# EAGLE board whitherbone (EAGLE 6.4), part 1 of 2
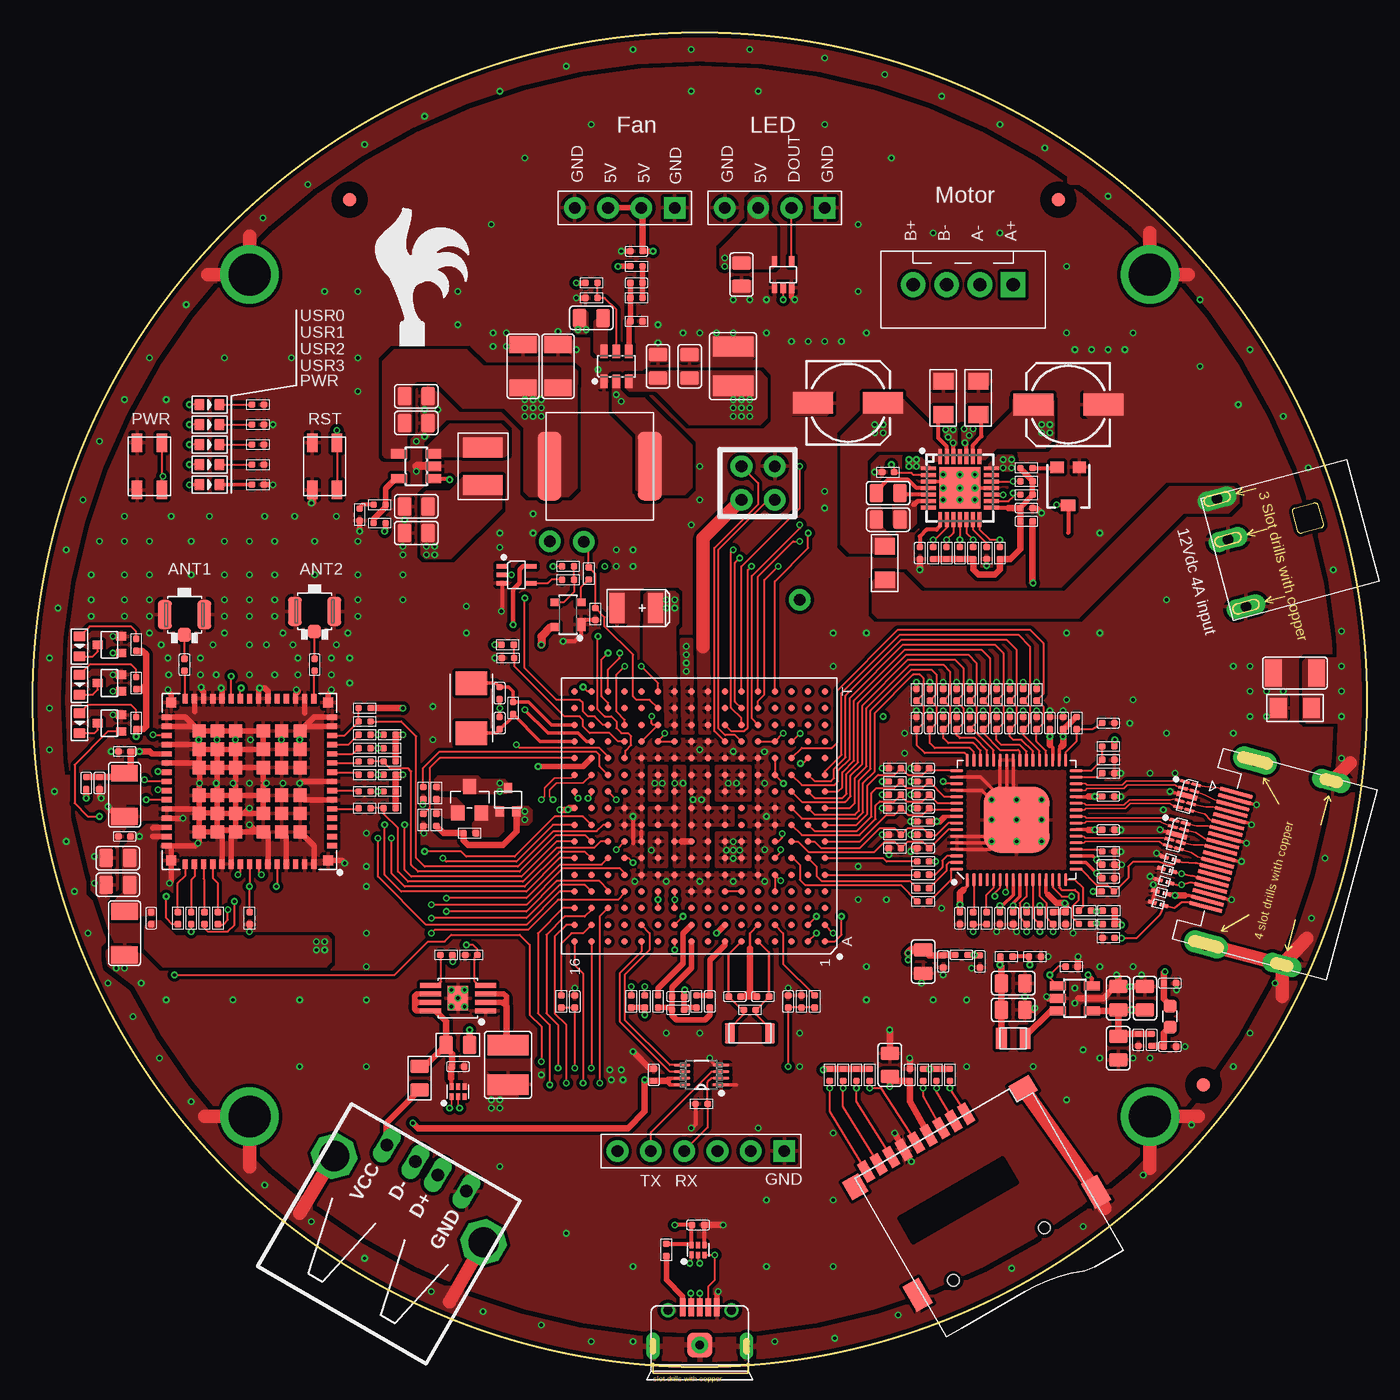
[diagram p9: board, top side]
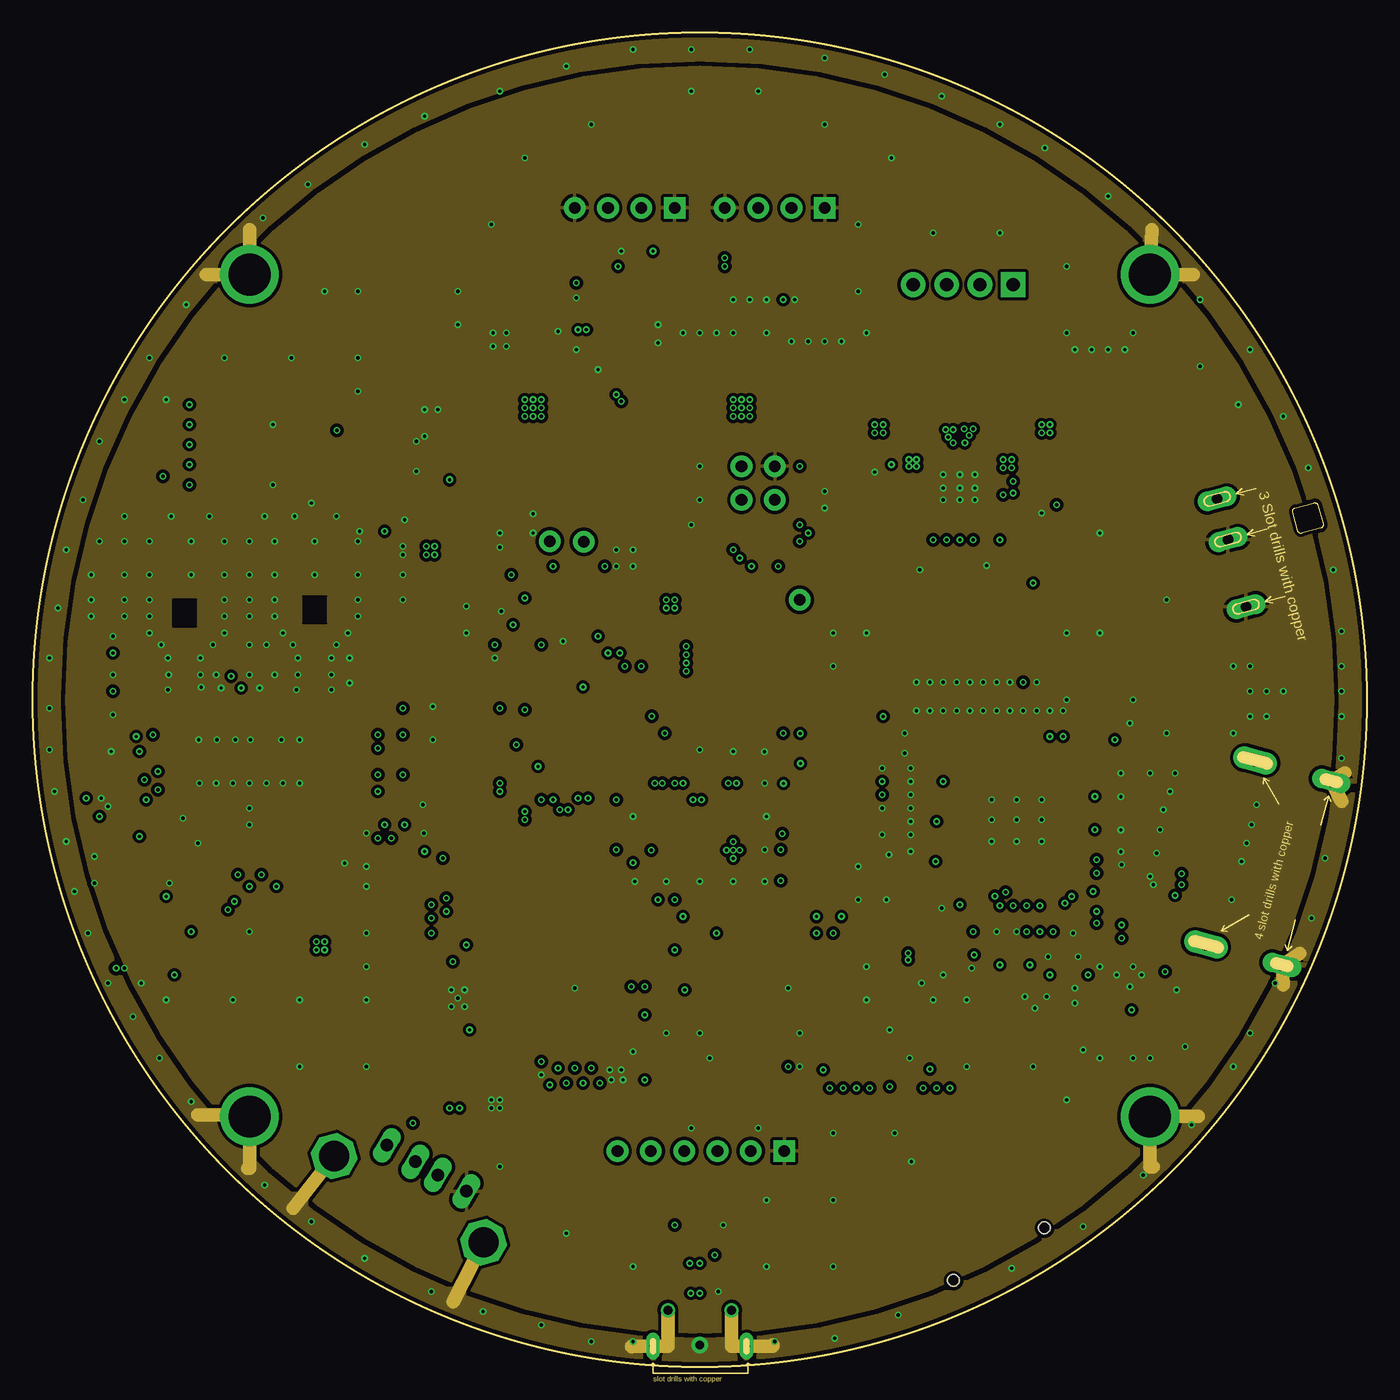
[diagram p10: board, inner layer GND2]
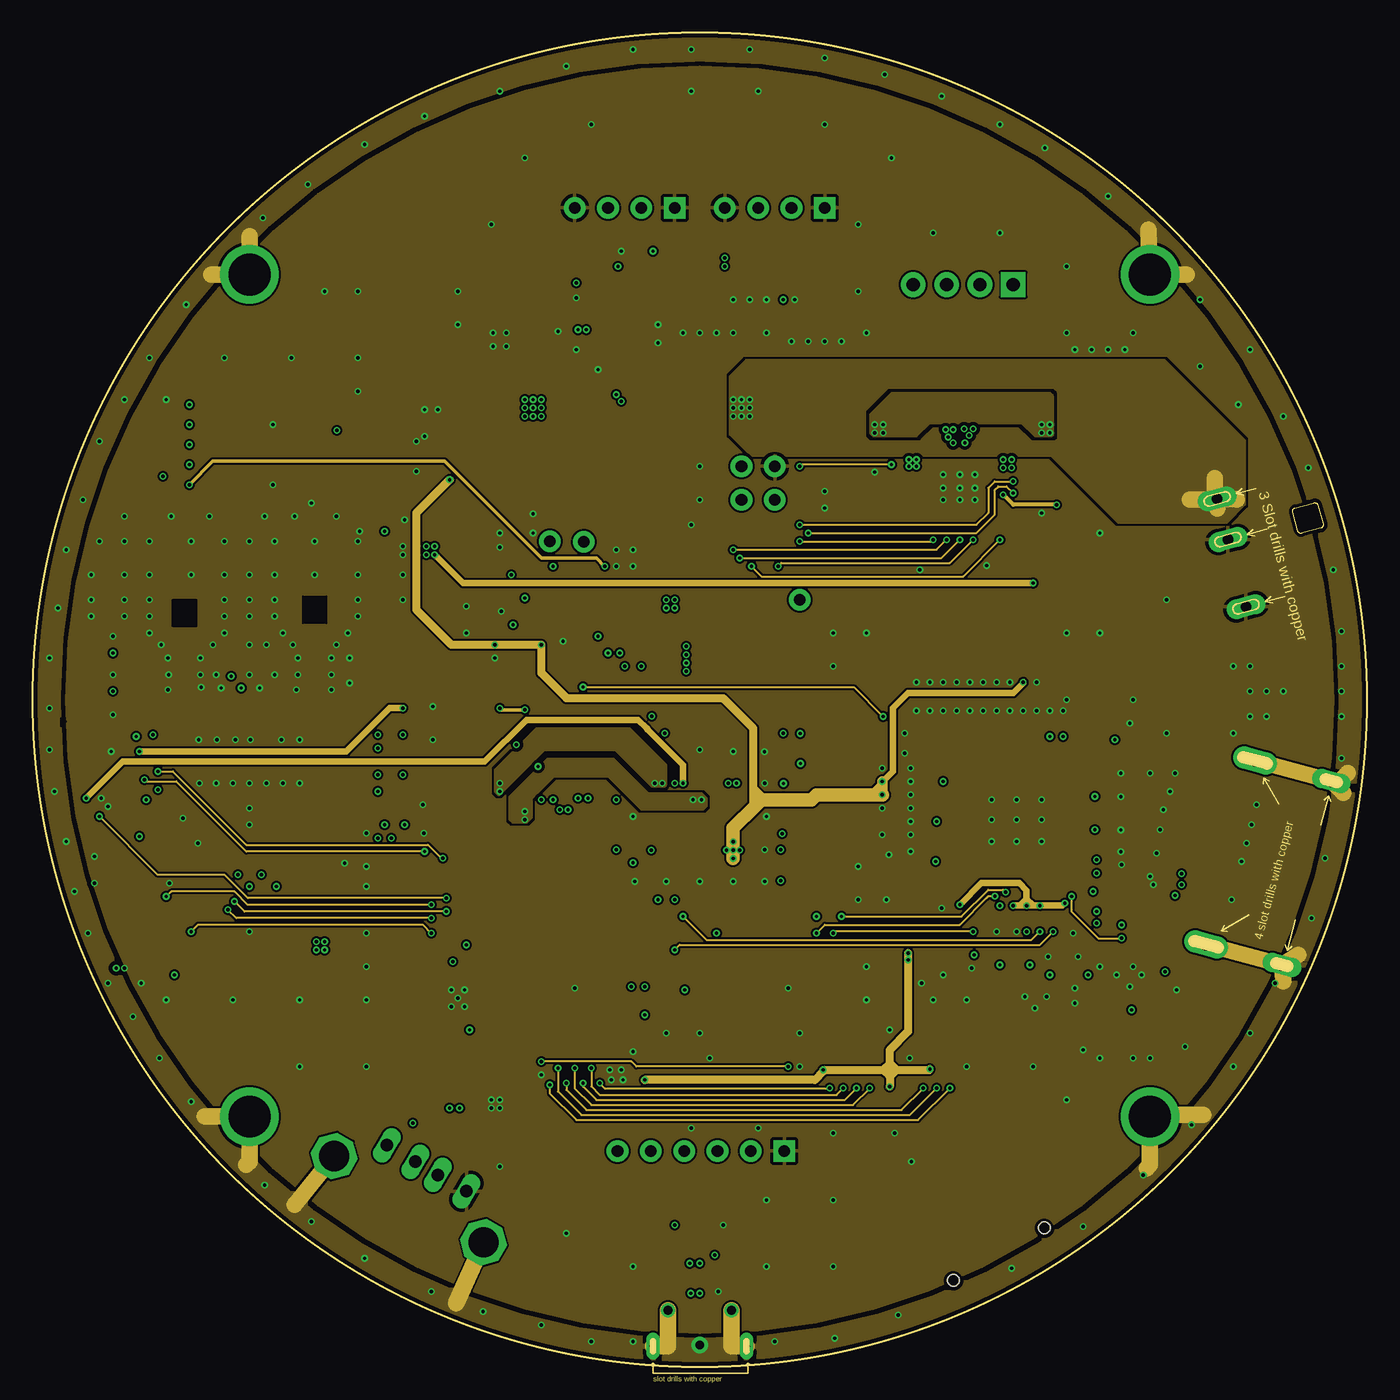
[diagram p11: board, inner layer Route15]
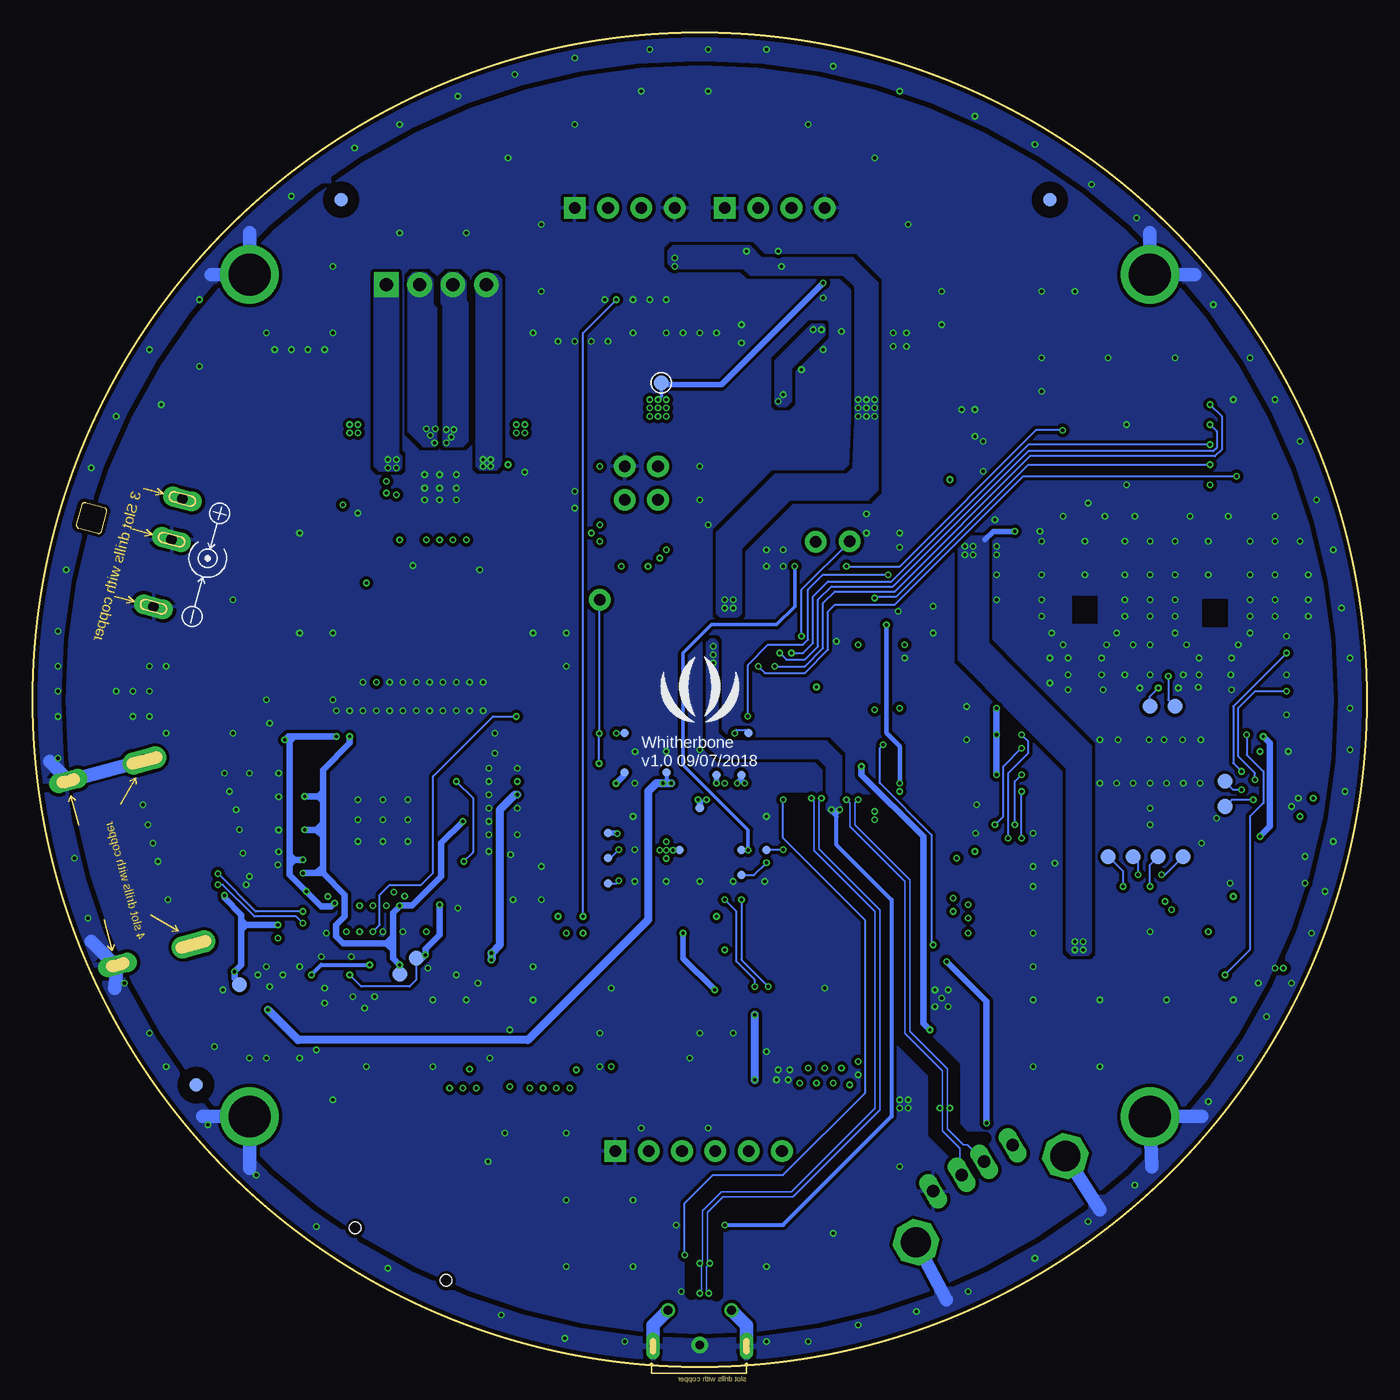
[diagram p12: board, bottom side, seen from below]

Size 101.6 x 101.6 mm. Coordinates in mm from the lower left corner, seen from the top.
Outline: circle at 50.8,50.8 radius 50.8
Copper layers (1*2*15*16): Top 0.035mm / dielectric 0.2mm / GND2 0.0175mm / dielectric 0.3mm / Route15 0.0175mm / dielectric 0.2mm / Bottom 0.035mm
Design rules "SeeedStudio_4layer_DRU_no_angle_20140221 *": minimum track width 1mil, minimum drill 10mil, track to track 6mil, track to pad 6mil, pad to pad 6mil, via to via 6mil, smd to smd 0mil, copper to edge 10mil, drill to drill 8mil, minimum pad ring 4mil, minimum via ring 4mil, stop-mask expansion 4mil, vias tented up to drill 25mil, thermal gap 10mil
Net classes: 0 default: width 0.102 mm, drill 0.254 mm; 1 ground: width 0.102 mm, drill 0.254 mm, clearance 0.152 mm
bRestrict: 11 lines

## Footprints (pad centres in the part's own frame; a part is rotated, then mirrored left to right if it is on the bottom)
U-FL3P-SMD-2.6X2.6X1.0MM = smd 1.05 x 1: D -1.524,0 | smd 2.2 x 1.05: GND1 0,1.5; GND2 0,-1.5
AVX-B = smd 1.143 x 2.286: + 1.46,0; - -1.46,0
C0402 = smd 0.5 x 0.5: 1 0,0.463; 2 0,-0.463
C1206 = smd 1.27 x 2.032: 1 -1.651,0; 2 1.651,0
C0805 = smd 1.397 x 1.016: 1 0,0.889; 2 0,-0.889
C1210 = smd 1.55 x 3.1: 1 -1.5,0; 2 1.5,0
ELECTRO-SMD-C-6MM = smd 3.048 x 1.651: + 2.667,0; - -2.667,0
LED-0603 = smd 0.762 x 0.889: + 0.762,0; - -0.762,0
SOD-923 = smd 0.7 x 0.3: 1 -0.45,0; 2 0.45,0
F0603 = smd 1 x 1: 1 -0.8,0; 2 0.8,0
FIDUCIAL_40MIL = smd 1.016 x 1.016: P$1 0,0
SON6-0.5-1.45X1X0.55MM = smd 0.3 x 0.52: 1 -0.5,-0.38 | smd 0.3 x 0.49: 2 0,-0.375; 3 0.5,-0.375; 4 0.5,0.375; 5 0,0.375; 6 -0.5,0.375
MICRO-USB5+5P-SMD-0.65-7.2X5.06MM = smd 0.4 x 1.35: 1 -1.3,2.875; 2 -0.65,2.875; 3 0,2.875; 4 0.65,2.875; 5 1.3,2.875 | smd 1.9 x 1.9: P1 0,0 | drill 0.508 pad 1.016 long: P3 -3.575,-0.08; P4 3.575,-0.08 | drill 0.7: P5 -2.425,2.65; P6 2.425,2.65
DCJ3P-11.6X9.6X7.0MM = drill 0.813 pad 1.524 long: + 4.45,10.3; - -4.05,10.3; CDN 1.25,10.3
MICRO-SD9+4P-SMD-16.1X14.5X1.85MM = smd 1.6 x 0.7: 1 0,2.25; 2 0,1.15; 3 0,0.05; 4 0,-1.05; 5 0,-2.15; 6 0,-3.25; 7 0,-4.35; 8 0,-5.45; 9 0,-6.55 | smd 1.6 x 1.4: G1 0.6,-7.85 | smd 2.2 x 1.4: G2 10.1,-7.85; G3 10.1,7.85 | smd 1.4 x 1.8: G4 0.5,6.95 | hole 0.9: 10.5,-4.95; 10.5,3.05
H6-2.54 = drill 0.889 pad 1.651 square: 1 0,6.35 | drill 0.889 pad 1.651: 2 0,3.81; 3 0,1.27; 4 0,-1.27; 5 0,-3.81; 6 0,-6.35
H4-2.54-10.2X5.6MM = drill 1.016 pad 1.88 square: 1 -3.81,0 | drill 1.016 pad 1.88: 2 -1.27,0; 3 1.27,0; 4 3.81,0
HDMI19P-0.5-15X12.15X6.18MM = smd 0.3 x 2.6: 1 4.5,0; 2 4,0; 3 3.5,0; 4 3,0; 5 2.5,0; 6 2,0; 7 1.5,0; 8 1,0; 9 0.5,0; 10 0,0; 11 -0.5,0; 12 -1,0; 13 -1.5,0; 14 -2,0; 15 -2.5,0; 16 -3,0; 17 -3.5,0; 18 -4,0; 19 -4.5,0 | drill 0.9 pad 1.7 long: PAD 7.25,-0.76; PAD1 -7.25,-0.76 | drill 0.9 pad 1.5 long: PAD2 7.25,-6.76; PAD3 -7.25,-6.76
H4-2.54 = drill 0.889 pad 1.651 square: 1 0,3.81 | drill 0.889 pad 1.651: 2 0,1.27; 3 0,-1.27; 4 0,-3.81
USB4+2-2.0-90D = drill 0.95 long: 1 -3.5,2.71; 2 -1,2.71; 3 1,2.71; 4 3.5,2.71 | drill 2.3 octagon: SG1 -6.57,0; SG2 6.57,0
L0402 = smd 0.5 x 0.5: 1 -0.463,0; 2 0.463,0
INT2-7.268-8.64X8.18X4MM = smd 1.8 x 5.2: 1 -3.82,0; 2 3.82,0
L0805 = smd 1.016 x 1.397: 1 -0.889,0; 2 0.889,0
L4.4X3.0MM = smd 1.55 x 3: 1 -1.425,0; 2 1.425,0
L201610 = smd 0.8 x 1.6: 1 -0.9,0; 2 0.9,0
MOUNTING_HOLE = drill 3.175 pad 4.445: P$1 0,0
SOT-323 = smd 0.635 x 0.762: 1 -0.635,-0.889; 2 0.635,-0.889; 3 0,0.889
R0402 = smd 0.5 x 0.5: 1 0,0.463; 2 0,-0.463
R1206 = smd 1.27 x 1.524: 1 -1.27,0; 2 1.27,0
BUTTON4P-SMD-4.5X3.2X2.5MM = smd 1.4 x 0.8: 1 -1.8,-0.94; 2 1.8,-0.94; 3 1.8,0.94; 4 -1.8,0.94
TP_4545 = smd 1.143 x 1.143: T 0,0
TP_B0,65 = smd 0.635 x 0.635: TP 0,0
TESTPAD/W_HOLE_1X1 = drill 0.889 pad 1.651: P$1 0,0
TP-D65/35MIL = drill 0.889 pad 1.651: P1 0,0
TP-D45MIL = smd 1.143 x 1.143: T 0,0
BGA256-1.27-21X21MM = smd 0.5 x 0.5: A1 -9.525,-9.525; A2 -9.525,-8.255; A3 -9.525,-6.985; A4 -9.525,-5.715; A5 -9.525,-4.445; A6 -9.525,-3.175; A7 -9.525,-1.905; A8 -9.525,-0.635; A9 -9.525,0.635; A10 -9.525,1.905; A11 -9.525,3.175; A12 -9.525,4.445; A13 -9.525,5.715; A14 -9.525,6.985; A15 -9.525,8.255; A16 -9.525,9.525; B1 -8.255,-9.525; B2 -8.255,-8.255; B3 -8.255,-6.985; B4 -8.255,-5.715; B5 -8.255,-4.445; B6 -8.255,-3.175; B7 -8.255,-1.905; B8 -8.255,-0.635; B9 -8.255,0.635; B10 -8.255,1.905; B11 -8.255,3.175; B12 -8.255,4.445; B13 -8.255,5.715; B14 -8.255,6.985; B15 -8.255,8.255; B16 -8.255,9.525; C1 -6.985,-9.525; C2 -6.985,-8.255; C3 -6.985,-6.985; C4 -6.985,-5.715; C5 -6.985,-4.445; C6 -6.985,-3.175; C7 -6.985,-1.905; C8 -6.985,-0.635; C9 -6.985,0.635; C10 -6.985,1.905; C11 -6.985,3.175; C12 -6.985,4.445; C13 -6.985,5.715; C14 -6.985,6.985; C15 -6.985,8.255; C16 -6.985,9.525; D1 -5.715,-9.525; D2 -5.715,-8.255; D3 -5.715,-6.985; D4 -5.715,-5.715; D5 -5.715,-4.445; D6 -5.715,-3.175; D7 -5.715,-1.905; D8 -5.715,-0.635; D9 -5.715,0.635; D10 -5.715,1.905; D11 -5.715,3.175; D12 -5.715,4.445; D13 -5.715,5.715; D14 -5.715,6.985; D15 -5.715,8.255; D16 -5.715,9.525; E1 -4.445,-9.525; E2 -4.445,-8.255; E3 -4.445,-6.985; E4 -4.445,-5.715; E5 -4.445,-4.445; E6 -4.445,-3.175; E7 -4.445,-1.905; E8 -4.445,-0.635; E9 -4.445,0.635; E10 -4.445,1.905; E11 -4.445,3.175; E12 -4.445,4.445; E13 -4.445,5.715; E14 -4.445,6.985; E15 -4.445,8.255; E16 -4.445,9.525; F1 -3.175,-9.525; F2 -3.175,-8.255; F3 -3.175,-6.985; F4 -3.175,-5.715; F5 -3.175,-4.445; F6 -3.175,-3.175; F7 -3.175,-1.905; F8 -3.175,-0.635; F9 -3.175,0.635; F10 -3.175,1.905; F11 -3.175,3.175; F12 -3.175,4.445; F13 -3.175,5.715; F14 -3.175,6.985; F15 -3.175,8.255; F16 -3.175,9.525; G1 -1.905,-9.525; G2 -1.905,-8.255; G3 -1.905,-6.985; G4 -1.905,-5.715; G5 -1.905,-4.445; G6 -1.905,-3.175; G7 -1.905,-1.905; G8 -1.905,-0.635; G9 -1.905,0.635; G10 -1.905,1.905; G11 -1.905,3.175; G12 -1.905,4.445; G13 -1.905,5.715; G14 -1.905,6.985; G15 -1.905,8.255; G16 -1.905,9.525; H1 -0.635,-9.525; H2 -0.635,-8.255; H3 -0.635,-6.985; H4 -0.635,-5.715; H5 -0.635,-4.445; H6 -0.635,-3.175; H7 -0.635,-1.905; H8 -0.635,-0.635; H9 -0.635,0.635; H10 -0.635,1.905; H11 -0.635,3.175; H12 -0.635,4.445; H13 -0.635,5.715; H14 -0.635,6.985; H15 -0.635,8.255; H16 -0.635,9.525; J1 0.635,-9.525; J2 0.635,-8.255; J3 0.635,-6.985; J4 0.635,-5.715; J5 0.635,-4.445; J6 0.635,-3.175; J7 0.635,-1.905; J8 0.635,-0.635; J9 0.635,0.635; J10 0.635,1.905; J11 0.635,3.175; J12 0.635,4.445; J13 0.635,5.715; J14 0.635,6.985; J15 0.635,8.255; J16 0.635,9.525; K1 1.905,-9.525; K2 1.905,-8.255; K3 1.905,-6.985; K4 1.905,-5.715; K5 1.905,-4.445; K6 1.905,-3.175; K7 1.905,-1.905; K8 1.905,-0.635; K9 1.905,0.635; K10 1.905,1.905; K11 1.905,3.175; K12 1.905,4.445; K13 1.905,5.715; K14 1.905,6.985; K15 1.905,8.255; K16 1.905,9.525; L1 3.175,-9.525; L2 3.175,-8.255; L3 3.175,-6.985; L4 3.175,-5.715; L5 3.175,-4.445; L6 3.175,-3.175; L7 3.175,-1.905; L8 3.175,-0.635; L9 3.175,0.635; L10 3.175,1.905; L11 3.175,3.175; L12 3.175,4.445; L13 3.175,5.715; L14 3.175,6.985; L15 3.175,8.255; L16 3.175,9.525; M1 4.445,-9.525; M2 4.445,-8.255; M3 4.445,-6.985; M4 4.445,-5.715; M5 4.445,-4.445; M6 4.445,-3.175; M7 4.445,-1.905; M8 4.445,-0.635; M9 4.445,0.635; M10 4.445,1.905; M11 4.445,3.175; M12 4.445,4.445; M13 4.445,5.715; M14 4.445,6.985; M15 4.445,8.255; M16 4.445,9.525; N1 5.715,-9.525; N2 5.715,-8.255; N3 5.715,-6.985; N4 5.715,-5.715; N5 5.715,-4.445; N6 5.715,-3.175; N7 5.715,-1.905; N8 5.715,-0.635; N9 5.715,0.635; N10 5.715,1.905; N11 5.715,3.175; N12 5.715,4.445; N13 5.715,5.715; N14 5.715,6.985; N15 5.715,8.255; N16 5.715,9.525; P1 6.985,-9.525; P2 6.985,-8.255; P3 6.985,-6.985; P4 6.985,-5.715; P5 6.985,-4.445; P6 6.985,-3.175; P7 6.985,-1.905; P8 6.985,-0.635; P9 6.985,0.635; P10 6.985,1.905; P11 6.985,3.175; P12 6.985,4.445; P13 6.985,5.715; P14 6.985,6.985; P15 6.985,8.255; P16 6.985,9.525; R1 8.255,-9.525; R2 8.255,-8.255; R3 8.255,-6.985; R4 8.255,-5.715; R5 8.255,-4.445; R6 8.255,-3.175; R7 8.255,-1.905; R8 8.255,-0.635; R9 8.255,0.635; R10 8.255,1.905; R11 8.255,3.175; R12 8.255,4.445; R13 8.255,5.715; R14 8.255,6.985; R15 8.255,8.255; R16 8.255,9.525; T1 9.525,-9.525; T2 9.525,-8.255; T3 9.525,-6.985; T4 9.525,-5.715; T5 9.525,-4.445; T6 9.525,-3.175; T7 9.525,-1.905; T8 9.525,-0.635; T9 9.525,0.635; T10 9.525,1.905; T11 9.525,3.175; T12 9.525,4.445; T13 9.525,5.715; T14 9.525,6.985; T15 9.525,8.255; T16 9.525,9.525
5P-SMD-2X1.2X1MM = smd 0.35 x 0.85: 1 -0.65,-1.1; 2 0,-1.1; 3 0.65,-1.1; 4 0.65,1.1; 5 -0.65,1.1
SOT-23 = smd 1.016 x 1.143: 1 -0.889,-1.016; 2 0.889,-1.016; 3 0,1.016
MODULE100P-0.7-13.5X13.2MM = smd 0.75 x 0.75: 1 -6.025,-5.975; 17 6.025,-5.975; 33 6.025,5.975; 49 -6.025,5.975 | smd 0.4 x 0.75: 2 -4.9,-6.3; 3 -4.2,-6.3; 4 -3.5,-6.3; 5 -2.8,-6.3; 6 -2.1,-6.3; 7 -1.4,-6.3; 8 -0.7,-6.3; 9 0,-6.3; 10 0.7,-6.3; 11 1.4,-6.3; 12 2.1,-6.3; 13 2.8,-6.3; 14 3.5,-6.3; 15 4.2,-6.3; 16 4.9,-6.3; 34 4.9,6.3; 35 4.2,6.3; 36 3.5,6.3; 37 2.8,6.3; 38 2.1,6.3; 39 1.4,6.3; 40 0.7,6.3; 41 0,6.3; 42 -0.7,6.3; 43 -1.4,6.3; 44 -2.1,6.3; 45 -2.8,6.3; 46 -3.5,6.3; 47 -4.2,6.3; 48 -4.9,6.3 | smd 0.75 x 0.4: 18 6.3,-4.9; 19 6.3,-4.2; 20 6.3,-3.5; 21 6.3,-2.8; 22 6.3,-2.1; 23 6.3,-1.4; 24 6.3,-0.7; 25 6.3,0; 26 6.3,0.7; 27 6.3,1.4; 28 6.3,2.1; 29 6.3,2.8; 30 6.3,3.5; 31 6.3,4.2; 32 6.3,4.9; 50 -6.3,4.9; 51 -6.3,4.2; 52 -6.3,3.5; 53 -6.3,2.8; 54 -6.3,2.1; 55 -6.3,1.4; 56 -6.3,0.7; 57 -6.3,0; 58 -6.3,-0.7; 59 -6.3,-1.4; 60 -6.3,-2.1; 61 -6.3,-2.8; 62 -6.3,-3.5; 63 -6.3,-4.2; 64 -6.3,-4.9 | smd 1 x 1: G1 -3.85,-3.85; G2 -2.45,-3.85; G3 -1.05,-3.85; G4 1.05,-3.85; G5 2.45,-3.85; G6 3.85,-3.85; G7 -3.85,-2.45; G8 -2.45,-2.45; G9 -1.05,-2.45; G10 1.05,-2.45; G11 2.45,-2.45; G12 3.85,-2.45; G13 -3.85,-1.05; G14 -2.45,-1.05; G15 -1.05,-1.05; G16 1.05,-1.05; G17 2.45,-1.05; G18 3.85,-1.05; G19 -3.85,1.05; G20 -2.45,1.05; G21 -1.05,1.05; G22 1.05,1.05; G23 2.45,1.05; G24 3.85,1.05; G25 -3.85,2.45; G26 -2.45,2.45; G27 -1.05,2.45; G28 1.05,2.45; G29 2.45,2.45; G30 3.85,2.45; G31 -3.85,3.85; G32 -2.45,3.85; G33 -1.05,3.85; G34 1.05,3.85; G35 2.45,3.85; G36 3.85,3.85
SOT143-R = smd 1 x 0.7: 1 -0.75,-1 | smd 0.6 x 0.7: 2 0.95,-1; 3 0.95,1; 4 -0.95,1
SOT-23-6 = smd 0.55 x 1.016: 1 -0.95,-1.143; 2 0,-1.143; 3 0.95,-1.143; 4 0.95,1.143; 5 0,1.143; 6 -0.95,1.143
MSOP8-0.65-3X3MM = smd 0.4 x 1.6: 1 -0.975,-2.1; 2 -0.325,-2.1; 3 0.325,-2.1; 4 0.975,-2.1; 5 0.975,2.1; 6 0.325,2.1; 7 -0.325,2.1; 8 -0.975,2.1 | smd 1.89 x 1.57: 9 0,0
SOT-23-5 = smd 0.69 x 1.2: 1 -0.95,-1.3; 2 0,-1.3; 3 0.95,-1.3; 4 0.95,1.3; 5 -0.95,1.3
SOT-353 = smd 0.4 x 0.8: 1 -0.65,-1; 2 0,-1; 3 0.65,-1; 4 0.65,1; 5 -0.65,1
DCU8 = smd 1.27 x 0.254: 1 -1.473,0.749; 2 -1.473,0.249; 3 -1.473,-0.249; 4 -1.473,-0.749; 5 1.473,-0.749; 6 1.473,-0.249; 7 1.473,0.249; 8 1.473,0.749
QFN64-0.5-9X9MM = smd 1 x 0.25: 1 -4.55,3.75; 2 -4.55,3.25; 3 -4.55,2.75; 4 -4.55,2.25; 5 -4.55,1.75; 6 -4.55,1.25; 7 -4.55,0.75; 8 -4.55,0.25; 9 -4.55,-0.25; 10 -4.564,-0.75; 11 -4.55,-1.25; 12 -4.55,-1.75; 13 -4.55,-2.25; 14 -4.55,-2.75; 15 -4.55,-3.25; 16 -4.55,-3.75; 33 4.55,-3.75; 34 4.55,-3.25; 35 4.55,-2.75; 36 4.55,-2.25; 37 4.55,-1.75; 38 4.55,-1.25; 39 4.55,-0.75; 40 4.55,-0.25; 41 4.55,0.25; 42 4.55,0.75; 43 4.55,1.25; 44 4.55,1.75; 45 4.55,2.25; 46 4.55,2.75; 47 4.55,3.25; 48 4.55,3.75 | smd 0.25 x 1: 17 -3.75,-4.55; 18 -3.25,-4.55; 19 -2.75,-4.55; 20 -2.25,-4.55; 21 -1.75,-4.55; 22 -1.25,-4.55; 23 -0.75,-4.55; 24 -0.25,-4.55; 25 0.25,-4.55; 26 0.75,-4.55; 27 1.25,-4.55; 28 1.75,-4.55; 29 2.25,-4.55; 30 2.75,-4.55; 31 3.25,-4.55; 32 3.75,-4.55; 49 3.75,4.55; 50 3.25,4.55; 51 2.75,4.55; 52 2.25,4.55; 53 1.75,4.55; 54 1.25,4.55; 55 0.75,4.55; 56 0.25,4.55; 57 -0.25,4.55; 58 -0.75,4.55; 59 -1.25,4.55; 60 -1.75,4.55; 61 -2.25,4.55; 62 -2.75,4.55; 63 -3.25,4.55; 64 -3.75,4.55 | smd 5 x 5: 65 0,0
QFN-28-5MM = smd 1.15 x 0.3: 1 -2.4,1.5; 2 -2.4,1; 3 -2.4,0.5; 4 -2.4,0; 5 -2.4,-0.5; 6 -2.4,-1; 7 -2.4,-1.5; 15 2.4,-1.5; 16 2.4,-1; 17 2.4,-0.5; 18 2.4,0; 19 2.4,0.5; 20 2.4,1; 21 2.4,1.5 | smd 0.3 x 1.15: 8 -1.5,-2.4; 9 -1,-2.4; 10 -0.5,-2.4; 11 0,-2.4; 12 0.5,-2.4; 13 1,-2.4; 14 1.5,-2.4; 22 1.5,2.4; 23 1,2.4; 24 0.5,2.4; 25 0,2.4; 26 -0.5,2.4; 27 -1,2.4; 28 -1.5,2.4 | smd 3.15 x 3.15: PAD 0,0
ESD10P-0.5-2.5X1X0.58MM = smd 0.25 x 0.7: 1 -1,-0.45; 2 -0.5,-0.45; 4 0.5,-0.45; 5 1,-0.45; 6 1,0.45; 7 0.5,0.45; 9 -0.5,0.45; 10 -1,0.45 | smd 0.4 x 0.7: 3 0,-0.45 | smd 0.4 x 0.9: 8 0,0.35
ADJR3-SMD-3.6X3.3MM = smd 1 x 0.9: 1 -0.85,-1.45; 3 0.85,-1.45 | smd 1.1 x 0.9: 2 0,1.45
X2-SMD-3.2X1.5X0.55MM = smd 0.762 x 1.524: 1 -1.524,0; 2 1.524,0
CRYSTAL-TXC-7A = smd 1.788 x 2.413: P$1 1.9,0; P$2 -1.9,0

## Placement (x,y rotation side)
ANT1  RECE.20279.001E.01  [U-FL3P-SMD-2.6X2.6X1.0MM]  11.56,57.28 90 top
ANT2  RECE.20279.001E.01  [U-FL3P-SMD-2.6X2.6X1.0MM]  21.46,57.53 90 top
C1  TLJB227M006R0500  [AVX-B]  45.97,57.78 0 top
C2  1uF 10V  [C0402]  5.08,44.45 0 top
C3  47uF DNP  [C1206]  6.98,33.02 90 top
C4  10uF 25V  [C0805]  6.48,36.7 270 top
C5  10uF 25V  [C0805]  6.48,38.73 270 top
C6  100nF 25V  [C0402]  6.98,40.39 270 top
C7  47uF DNP  [C1206]  6.98,43.56 90 top
C8  1uF 10V  [C0402]  6.98,46.86 270 top
C9  10pF  [C0402]  11.56,53.47 0 top
C10  10pF  [C0402]  21.46,53.47 0 top
C11  1nF 1000V  [C1206]  96.14,52.83 0 top
C12  18pF 50V  [C0402]  35.56,51.31 0 top
C13  18pF 50V  [C0402]  35.56,49.02 180 top
C14  18pF 50V  [C0402]  53.47,28.19 90 top
C15  18pF 50V  [C0402]  55.63,28.19 270 top
C16  100uF 16V  [C1210]  53.34,76.2 270 top
C17  100nF 50V  [C0805]  47.62,76.2 0 top
C18  10uF 25V  [C0805]  50.04,76.2 0 top
C19  100nF 50V  [C0805]  42.54,79.88 90 top
C20  100nF 25V  [C0402]  50.67,10.79 90 top
C21  22uF 16V  [C1206]  37.34,76.2 270 top
C22  22uF 16V  [C1206]  40,76.2 270 top
C23  75pF 50V  [C0402]  45.97,82.55 270 top
C24  100uF 16V  [C1210]  36.19,22.99 270 top
C25  100nF 25V  [C0402]  49.15,28.19 270 top
C26  1uF 10V  [C0402]  45.97,84.96 90 top
C27  100nF 25V  [C0402]  49.15,27.18 270 top
C28  100nF 25V  [C0402]  51.56,27.81 0 top
C29  10uF 25V  [C0805]  29.21,73.91 270 top
C30  10uF 25V  [C0805]  29.21,71.88 270 top
C31  100nF 25V  [C0402]  32.38,22.86 90 top
C32  10uF 25V  [C0805]  65.28,22.99 180 top
C33  10uF 25V  [C0805]  53.97,83.19 180 top
C34  100nF 25V  [C0402]  66.8,22.22 180 top
C35  10uF 25V  [C0805]  29.21,65.53 90 top
C36  10uF 25V  [C0805]  29.21,63.5 90 top
C37  DNI  [C0402]  57.53,27.81 0 top
C38  1uF 10V  [C0402]  81.91,49.02 270 top
C39  33pF 50V  [C0402]  71.37,49.02 180 top
C40  DNI  [C0402]  41.27,27.81 0 top
C41  33pF 50V  [C0402]  70.36,49.02 180 top
C42  33pF 50V  [C0402]  69.34,49.02 180 top
C43  33pF 50V  [C0402]  68.33,49.02 180 top
C44  100nF 25V  [C0402]  47.29,22.24 0 top
C45  33pF 50V  [C0402]  67.31,49.02 180 top
C46  33pF 50V  [C0402]  67.82,45.59 270 top
C47  33pF 50V  [C0402]  76.45,49.02 180 top
C48  47uF 25V  [ELECTRO-SMD-C-6MM]  78.87,73.28 180 top
C49  33pF 50V  [C0402]  75.44,49.02 180 top
C50  33pF 50V  [C0402]  74.42,49.02 180 top
C51  47uF 25V  [ELECTRO-SMD-C-6MM]  62.1,73.41 0 top
C52  33pF 50V  [C0402]  73.41,49.02 180 top
C53  100nF 25V  [C0402]  75.69,65.41 90 top
C54  33pF 50V  [C0402]  72.39,49.02 180 top
C55  33pF 50V  [C0402]  67.82,44.58 270 top
C56  100nF 50V  [C0805]  65.15,66.55 90 top
C57  33pF 50V  [C0402]  67.82,43.56 270 top
C58  33pF 50V  [C0402]  67.82,42.54 270 top
C59  33pF 50V  [C0402]  67.82,40.51 270 top
C60  33pF 50V  [C0402]  67.82,39.5 270 top
C61  100nF 25V  [C0402]  73.66,34.16 180 top
C62  100nF 25V  [C0402]  77.47,49.02 0 top
C63  100nF 25V  [C0402]  67.82,41.53 90 top
C64  100nF 25V  [C0402]  81.91,43.43 270 top
C65  100nF 25V  [C0402]  81.91,40.89 270 top
C66  100nF 25V  [C0402]  81.91,37.21 270 top
C67  220nF  [C0402]  67.56,61.98 0 top
C68  100nF 50V  [C0805]  65.15,64.52 270 top
C69  100nF 25V  [C0402]  81.91,38.23 270 top
C70  10uF 25V  [C0805]  67.82,30.86 180 top
C71  100nF 25V  [C0402]  74.68,34.16 180 top
C72  100nF 25V  [C0402]  69.34,30.86 180 top
C73  100nF 25V  [C0402]  78.68,34.16 180 top
C74  10uF 25V  [C0805]  84.71,28.07 0 top
C75  10uF 25V  [C0805]  82.68,28.07 0 top
C76  100nF 25V  [C0402]  72.14,30.86 180 top
C77  100nF 25V  [C0402]  70.61,34.16 180 top
C78  100nF 25V  [C0402]  78.49,49.02 0 top
C79  10uF 25V  [C0805]  82.68,24.26 180 top
C80  100nF 25V  [C0402]  84.2,24.89 180 top
C81  100nF 25V  [C0402]  86.61,24.38 270 top
C82  10uF 25V  [C0805]  74.68,27.18 270 top
C83  10uF 25V  [C0805]  74.68,29.21 270 top
C84  1uF 10V  [C0402]  86.61,29.21 270 top
D1  Red  [LED-0603]  3.56,49.02 90 top
D2  Green  [LED-0603]  3.56,54.86 90 top
D3  Green  [LED-0603]  3.56,51.94 90 top
D4  Green  [LED-0603]  13.46,67.18 180 top
D5  Red  [LED-0603]  13.46,73.28 180 top
D6  Red  [LED-0603]  13.46,71.75 180 top
D7  Red  [LED-0603]  13.46,70.23 180 top
D8  Red  [LED-0603]  13.46,68.71 180 top
D9  DF2S6.8FS  [SOD-923]  86.41,37.83 165 top
D10  DF2S6.8FS  [SOD-923]  86.18,36.97 165 top
D11  DF2S6.8FS  [SOD-923]  85.95,36.11 165 top
D12  DF2S6.8FS  [SOD-923]  86.64,38.69 165 top
D13  DF2S6.8FS  [SOD-923]  85.72,35.25 165 top
F1  MF-FSMF010X  [F0603]  86.61,26.67 90 top
FUD1  FIDUCIAL  [FIDUCIAL_40MIL]  78.1,88.9 0 top
FUD2  FIDUCIAL  [FIDUCIAL_40MIL]  24.13,88.9 0 top
FUD3  FIDUCIAL  [FIDUCIAL_40MIL]  89.15,21.46 0 top
FUD4  FIDUCIAL  [FIDUCIAL_40MIL]  24.13,88.9 90 bottom
FUD5  FIDUCIAL  [FIDUCIAL_40MIL]  89.15,21.46 90 bottom
FUD6  FIDUCIAL  [FIDUCIAL_40MIL]  78.1,88.9 90 bottom
IC1  TPD4S012DRYR  [SON6-0.5-1.45X1X0.55MM]  50.67,8.89 0 top
IC2  TPD4S012DRYR  [SON6-0.5-1.45X1X0.55MM]  32.38,20.95 0 top
J1  ST-USB-01H2  [MICRO-USB5+5P-SMD-0.65-7.2X5.06MM]  50.8,1.65 0 top
J2  DC-044  [DCJ3P-11.6X9.6X7.0MM]  101.31,64.47 105 top
J3  ST-TF-003J  [MICRO-SD9+4P-SMD-16.1X14.5X1.85MM]  69.15,18.14 300 top
J4  6p-2.54 DNP  [H6-2.54]  50.88,16.43 270 top
J5  WY-1223  [H4-2.54-10.2X5.6MM]  70.87,82.42 180 top
J6  ST-HD-010  [HDMI19P-0.5-15X12.15X6.18MM]  90.5,39.36 75 top
J7  2510S-4P(T)  [H4-2.54]  56.52,88.27 270 top
J8  2510S-4P(T)  [H4-2.54]  45.08,88.27 270 top
JP2  ST-USB-003A  [USB4+2-2.0-90D]  28.64,12.76 330 top
L1  BLM15PD121SN1D  [L0402]  4.06,44.45 90 top
L2  BLM15PD121SN1D  [L0402]  9.02,34.16 90 top
L3  IHLP3232DZER100M01  [INT2-7.268-8.64X8.18X4MM]  43.18,68.58 180 top
L4  BLM21PG331SN1D  [L0805]  32.38,24.51 0 top
L5  BLM21PG331SN1D  [L0805]  29.46,21.97 270 top
L6  LQH44PN1R0NP0L  [L4.4X3.0MM]  34.29,68.58 270 top
L7  BLM15PD121SN1D  [L0402]  75.69,64.39 180 top
L8  BLM15PD121SN1D  [L0402]  70.74,31.37 0 top
L9  BLM15PD121SN1D  [L0402]  85.22,24.89 270 top
L10  WPN201610MR47MT  [L201610]  74.68,25.02 180 top
MGT1  MOUNTING_HOLE  [MOUNTING_HOLE]  16.51,83.19 90 top
MGT2  MOUNTING_HOLE  [MOUNTING_HOLE]  16.51,19.05 90 top
MGT3  MOUNTING_HOLE  [MOUNTING_HOLE]  85.09,19.05 90 top
MGT4  MOUNTING_HOLE  [MOUNTING_HOLE]  85.09,83.19 90 top
Q1  BSS138W-7-F  [SOT-323]  5.84,49.02 90 top
Q2  BSS138W-7-F  [SOT-323]  5.84,54.99 90 top
Q3  BSS138W-7-F  [SOT-323]  5.84,52.07 90 top
Q4  MMBT2907A  [SOT-323]  36.19,43.18 0 top
R1  1.5k 1%  [R0402]  46.61,27.81 0 top
R2  1.5k 1%  [R0402]  45.59,27.81 0 top
R3  10k 1%  [R0402]  29.74,41.66 0 top
R4  10k  [R0402]  27.18,45.08 270 top
R5  1k  [R0402]  7.87,49.02 0 top
R6  10k  [R0402]  27.18,46.1 270 top
R7  10k  [R0402]  27.18,47.12 270 top
R8  10k  [R0402]  27.18,48.13 270 top
R9  10k  [R0402]  27.18,43.81 270 top
R10  10k  [R0402]  27.18,42.54 270 top
R11  1k  [R0402]  7.87,54.99 0 top
R12  1k  [R0402]  7.87,52.07 0 top
R13  33R  [R0402]  11.05,34.16 0 top
R14  33R  [R0402]  12.06,34.16 0 top
R15  33R  [R0402]  13.08,34.16 0 top
R16  33R  [R0402]  14.1,34.16 0 top
R17  499R  [R0402]  33.27,40.64 270 top
R18  1.5k 1%  [R0402]  17.14,67.18 90 top
R19  33R  [R0402]  25.27,42.54 90 top
R20  40.2k 1%  [R0402]  30.73,43.69 0 top
R21  10k 1%  [R0402]  30.73,41.66 0 top
R22  33R  [R0402]  25.27,43.81 90 top
R23  0R  [R0402]  40.77,60.96 90 top
R24  0R  [R0402]  40.77,59.94 90 top
R25  33R  [R0402]  25.27,45.08 90 top
R26  33R  [R0402]  25.27,46.1 90 top
R27  33R  [R0402]  25.27,47.12 90 top
R28  33R  [R0402]  25.27,48.13 90 top
R29  33R  [R0402]  25.27,49.15 90 top
R30  DNP 10k  [R0402]  25.27,50.16 270 top
R31  1k  [R0402]  42.34,60.43 0 top
R32  100K, 1%, DNI  [R0402]  42.85,57.33 180 top
R33  100k 1%  [R0402]  76.45,51.18 0 top
R34  100k 1%  [R0402]  75.44,51.18 180 top
R35  100k 1%  [R0402]  74.42,51.18 0 top
R36  100k 1%  [R0402]  73.41,51.18 0 top
R37  100k 1%  [R0402]  72.39,51.18 0 top
R38  100k 1%  [R0402]  71.37,51.18 0 top
R39  100k 1%  [R0402]  70.36,51.18 0 top
R40  100k 1%  [R0402]  69.34,51.18 0 top
R41  100k 1%  [R0402]  68.33,51.18 0 top
R42  100k 1%  [R0402]  67.31,51.18 0 top
R43  100k 1%  [R0402]  65.66,45.59 90 top
R44  100k 1%  [R0402]  65.66,44.58 270 top
R45  100k 1%  [R0402]  65.66,43.56 270 top
R46  100k 1%  [R0402]  65.66,42.54 90 top
R47  0R  [R0402]  48.26,8.89 180 top
R48  0R  [R1206]  96.14,50.16 0 top
R49  100k 1%  [R0402]  65.66,40.51 90 top
R50  100k 1%  [R0402]  65.66,39.5 90 top
R51  1.5k 1%  [R0402]  17.14,73.28 90 top
R52  1.5k 1%  [R0402]  17.14,71.75 90 top
R53  1.5k 1%  [R0402]  17.14,70.23 90 top
R54  1.5k 1%  [R0402]  17.14,68.71 90 top
R55  1M 1%  [R0402]  36.58,50.16 180 top
R56  1M, 1%, DNI  [R0402]  54.61,27.18 270 top
R57  560k 1%  [R0402]  42.54,82.55 270 top
R58  100k 1%  [R0402]  42.54,81.41 90 top
R59  49.9R 1%  [R0402]  45.97,83.82 270 top
R60  100k 1%  [R0402]  45.97,81.41 90 top
R61  13.3k 1%  [R0402]  45.97,79.63 270 top
R62  10k 1%  [R0402]  33.4,31.37 270 top
R63  10k  [R0402]  31.5,31.37 270 top
R64  0R  [R0402]  29.74,43.69 180 top
R65  0R  [R0402]  50.55,27.81 180 top
R66  0R  [R0402]  47.62,27.81 0 top
R67  10k  [R0402]  69.85,22.22 180 top
R68  10k  [R0402]  67.82,22.22 180 top
R69  10k 1%  [R0402]  36.17,54.99 270 top
R70  10k 1%  [R0402]  36.19,53.97 90 top
R71  10k  [R0402]  63.75,22.22 180 top
R72  10k  [R0402]  62.74,22.22 180 top
R73  10k  [R0402]  61.72,22.22 180 top
R74  10k  [R0402]  68.83,22.22 180 top
R75  10k  [R0402]  60.71,22.22 180 top
R76  51k 1%  [R0402]  26.42,65.66 90 top
R77  1.3k 1%  [R0402]  24.89,64.9 180 top
R78  240k 1%  [R0402]  26.42,64.26 270 top
R79  1k  [R0402]  58.55,27.81 0 top
R80  100k 1%  [R0402]  50.94,20.02 90 top
R81  10k  [R0402]  76.71,34.16 0 top
R82  10k  [R0402]  77.72,34.16 0 top
R83  10k  [R0402]  75.69,34.16 0 top
R84  10k  [R0402]  79.5,49.02 0 top
R85  0R  [R0402]  72.64,34.16 180 top
R86  DNP  [R0402]  71.63,34.16 180 top
R87  10k  [R0402]  75.69,66.42 90 top
R88  10k  [R0402]  75.69,67.44 90 top
R89  10k  [R0402]  68.58,61.98 0 top
R90  10k  [R0402]  69.6,61.98 0 top
R91  10k  [R0402]  70.61,61.98 0 top
R92  10k  [R0402]  73.66,61.98 0 top
R93  10k  [R0402]  71.63,61.98 0 top
R94  10k  [R0402]  65.15,68.14 270 top
R95  22R  [R0402]  40.26,27.81 180 top
R96  1k  [R0402]  59.56,27.81 0 top
R97  0R  [R1206]  64.9,61.21 90 top
R98  10k  [R0402]  81.91,45.21 90 top
R99  5.6K 1%  [R0402]  81.91,39.24 270 top
R100  10k  [R0402]  81.91,47.24 270 top
R101  DNP  [R0402]  81.91,46.23 270 top
R102  22R  [R0402]  80.14,34.73 90 top
R103  22R  [R0402]  80.14,33.72 90 top
R104  2k  [R0402]  81.94,34.72 270 top
R105  2k  [R0402]  81.94,33.71 270 top
R106  10k  [R0402]  81.88,36.2 90 top
R107  33k  [R0402]  81.94,32.67 90 top
R108  10k  [R0402]  72.64,61.98 0 top
R109  10k  [R0402]  79.12,30.48 270 top
R110  0.1R  [R1206]  72.01,73.79 270 top
R111  0.1R  [R1206]  69.34,73.79 270 top
R112  10k  [R0402]  75.69,68.45 90 top
R113  100k 1%  [R0402]  74.17,31.24 270 top
R114  100k 1%  [R0402]  76.33,31.24 270 top
R115  22R  [R0402]  67.82,38.48 90 top
R116  0R  [R0402]  67.82,35.43 90 top
R117  0R  [R0402]  67.82,36.45 90 top
R118  0R  [R0402]  67.82,37.46 90 top
R119  10k  [R0402]  16.51,34.16 0 top
SW1  SKRPABE010  [BUTTON4P-SMD-4.5X3.2X2.5MM]  8.89,68.58 270 top
SW2  SKRPABE010  [BUTTON4P-SMD-4.5X3.2X2.5MM]  22.22,68.58 270 top
TP1  [TP_4545]  53.72,74.93 180 bottom
TP2  TPB0,65  [TP_B0,65]  57.78,40.64 0 bottom
TP3  TPB0,65  [TP_B0,65]  47.62,37.44 0 bottom
TP4  TPB0,65  [TP_B0,65]  45.72,39.34 0 bottom
TP5  TESTPAD/W_HOLE_1X1  [TESTPAD/W_HOLE_1X1]  53.97,66.04 270 top
TP6  TESTPAD/W_HOLE_1X1  [TESTPAD/W_HOLE_1X1]  53.97,68.58 270 top
TP7  TESTPAD/W_HOLE_1X1  [TESTPAD/W_HOLE_1X1]  56.52,66.04 270 top
TP8  TESTPAD/W_HOLE_1X1  [TESTPAD/W_HOLE_1X1]  56.52,68.58 270 top
TP9  TPB0,65  [TP_B0,65]  57.78,38.73 0 bottom
TP10  [TP-D65/35MIL]  58.42,58.42 0 top
TP11  TPB0,65  [TP_B0,65]  53.34,45.26 0 bottom
TP12  TPB0,65  [TP_B0,65]  52.32,39.34 0 bottom
TP13  TPB0,65  [TP_B0,65]  47.62,39.34 0 bottom
TP14  TPB0,65  [TP_B0,65]  47.62,45.07 90 bottom
TP15  TPB0,65  [TP_B0,65]  49.53,45.08 0 bottom
TP16  TPB0,65  [TP_B0,65]  50.8,42.57 0 bottom
TP17  [TP-D45MIL]  13.97,38.86 270 bottom
TP18  [TP-D45MIL]  73.66,29.91 90 bottom
TP19  [TP-D45MIL]  72.39,31.11 0 bottom
TP20  [TP-D45MIL]  85.85,29.08 270 bottom
TP21  TPB0,65  [TP_B0,65]  47.09,48.26 0 bottom
TP22  TPB0,65  [TP_B0,65]  56.54,48.26 0 bottom
TP23  TPB0,65  [TP_B0,65]  56.52,45.28 0 bottom
TP24  TPB0,65  [TP_B0,65]  57.78,36.8 0 bottom
TP25  [TP-D45MIL]  15.88,38.86 270 bottom
TP26  TESTPAD/W_HOLE_1X1  [TESTPAD/W_HOLE_1X1]  41.96,62.84 0 top
TP27  [TP-D45MIL]  17.78,38.86 270 bottom
TP28  [TP-D45MIL]  19.68,38.86 270 bottom
TP29  [TP-D45MIL]  16.51,50.29 270 bottom
TP30  [TP-D45MIL]  14.6,50.29 270 bottom
TP31  [TP-D45MIL]  10.79,44.58 270 bottom
TP32  [TP-D45MIL]  10.79,42.67 270 bottom
TP34  [TP-D65/35MIL]  39.37,62.86 0 top
U1  OSD3358-512M-BSM  [BGA256-1.27-21X21MM]  50.8,41.91 90 top
U2  SN74LVC1G07DCKR  [5P-SMD-2X1.2X1MM]  36.83,60.32 270 top
U3  ATL431AIDBZR  [SOT-23]  33.27,43.18 0 top
U4  WL1835MODGBMOCT  [MODULE100P-0.7-13.5X13.2MM]  16.51,44.58 90 top
U5  APX811-44UG-7  [SOT143-R]  40.77,57.28 90 top
U6  TPS54302  [SOT-23-6]  44.45,76.2 0 top
U7  TPS2051BDGNR  [MSOP8-0.65-3X3MM]  32.38,28.07 90 top
U8  TLV62569DBVT  [SOT-23-5]  29.21,68.58 90 top
U9  SN74LVC1G125DCKR  [SOT-353]  57.15,83.19 0 top
U10  SN74LVC2G241DCUR  [DCU8]  50.93,22.22 180 top
U11  IT66121FN  [QFN64-0.5-9X9MM]  74.93,41.66 90 top
U12  A4988SETTR-T  [QFN-28-5MM]  70.61,66.93 0 top
U13  ESD-RCLAMP0524P  [ESD10P-0.5-2.5X1X0.58MM]  87.92,43.47 255 top
U14  ESD-RCLAMP0524P  [ESD10P-0.5-2.5X1X0.58MM]  87.13,40.53 255 top
U16  TLV62569DBVT  [SOT-23-5]  79.38,28.07 270 top
U$1  [SEEED-SILK-TNAME-280*268MIL]  50.8,50.8 0 bottom
VR1  EVM3GSX50B14  [ADJR3-SMD-3.6X3.3MM]  78.87,67.06 180 top
X1  ST3215SB32768H5HPWAA  [X2-SMD-3.2X1.5X0.55MM]  54.61,25.4 180 top
Y1  CX3225GB24000P0HPQCC  [CRYSTAL-TXC-7A]  33.4,50.16 270 top

## Tracks (layer width: path | path; a pad name or v marks a point on that pad's centre or on a via)
1.8V-WIFI  (via drill 0.25 pad 0.51)
  Top 0.406: U4.38 9.08,46.68 8.89,46.86
  Top 0.508: R10.1 R9.1 R4.1 v28.19,45.08 | R6.1 R7.1 R8.1 v28.19,48.13 | R30.1 v28.19,50.16 | L1.2 C2.1 6.69,44.91 C7.2 7.45,45.67 C8.1 v8.13,46.86 8.89,46.86
  Route15 0.508: v8.13,46.86 23.88,46.86 27.18,50.16 v28.19,50.16
  Bottom 0.508: v28.19,45.08 v28.19,48.13 v28.19,50.16
3.3V-WIFI  (via drill 0.25 pad 0.51)
  Top 0.406: U4.47 9.15,40.38 9.14,40.39 | U4.46 9.2,41.08 9.14,41.02
  Top 0.508: v7.87,48.01 R5.2 8.43,48.56 8.64,48.77 8.64,51.31 | 8.64,51.31 8.64,51.56 | 8.64,51.56 8.64,51.94 | 8.64,51.94 8.64,54.23 8.34,54.53 R11.2 | R12.2 8.3,51.61 | 8.34,51.61 8.59,51.61 8.64,51.56 | 8.3,51.61 8.64,51.94 | 8.3,51.61 8.34,51.61 | 8.34,51.61 8.64,51.31
  Bottom 0.508: v8.13,40.39 7.37,41.15 7.37,47.5 v7.87,48.01
  pour Top (isolate 0.254, no thermals): 9.52,41.27 8.64,41.27 8,40.64 7.37,40.64 7.24,40.51 7.24,39.88 6.86,39.5 6.86,36.07 5.97,35.18 5.97,34.54 6.35,34.16 8,34.16 8.25,34.42 9.27,34.42 9.4,34.54 9.4,40 9.65,40.26 9.65,41.15
12VDC  (via drill 0.25 pad 0.51)
  other vias: 64.13,71.75 64.77,71.75 64.77,71.12 64.13,71.12 77.47,71.75 76.83,71.75 76.83,71.12 77.47,71.12
  pour Top (isolate 0.254, no thermals): 69.09,68.96 68.71,68.96 68.07,69.6 67.94,69.72 64.13,69.72 63.37,70.48 63.37,73.79 63.75,74.17 65.79,74.17 68.45,71.5 68.45,70.61 69.09,69.98
  pour Top (isolate 0.254, no thermals): 72.07,69.6 72.07,70.17 73.03,71.12 74.68,72.77 74.68,73.66 75.06,74.04 77.22,74.04 77.72,73.53 77.72,70.61 77.09,69.98 73.41,69.98 72.52,69.09 72.26,69.09 72.14,69.22 72.07,69.28
  pour Top (isolate 0.254, rank 2, no thermals): 64.26,61.98 62.23,61.98 61.59,62.61 61.59,70.87 62.48,71.75 63.25,72.52 64.64,72.52 65.15,72.01 65.15,70.61 63.5,68.96 63.5,65.79 63.75,65.53 64.52,65.53 64.64,65.41 64.64,64.01 65.53,63.12 65.53,62.36 65.15,61.98
  pour Route15 (isolate 0.254, no thermals): 64.39,70.87 67.31,70.87 68.33,71.88 75.31,71.88 76.33,70.87 77.6,70.87 77.72,70.99 77.72,73.91 77.47,74.17 65.41,74.17 63.75,72.52 63.75,71.12 64.01,70.87
AGND
  Top 0.152: 50.19,32.36 U1.A9
  Top 0.406: C28.2 51.56,26.8 51.18,26.42 49.02,26.42 48.69,26.75 C27.2 | R66.2 48.51,27.35 C27.2 | C27.2 C25.2 48.69,28.87 50.19,30.38 50.19,32.36
AIN7
  Top 0.152: U1.D6 U1.D7
B_UART0_RX
  Top 0.152: U10.2 51.69,21.98 51.4,21.68 R80.2 51.4,18.22 J4.4
B_UART0_TX
  Top 0.152: U10.3 51.68,22.47 47.07,17.86 J4.5
BAT_SENSE
  Top 0.152: U1.N7 51.92,48.41 51.92,62.36 55.24,65.68 55.24,67.31 TP6.P$1
BT_EN  (via drill 0.25 pad 0.51)
  Top 0.152: U4.41 8.64,44.58 v8.51,44.7 | Q3.1 v6.1,51.43 | U1.H15 41.91,41.91 39.75,41.91 36.7,38.86 33.02,38.86 32.64,39.24 v29.84,39.24
  Route15 0.152: v29.84,39.24 16.26,39.24 10.92,44.58 8.64,44.58 v8.51,44.7
  Bottom 0.152: v8.51,44.7 8.51,45.21 9.78,46.48 9.78,50.16 8.51,51.43 v6.1,51.43
BT_HCI_CTS  (via drill 0.25 pad 0.51)
  Top 0.152: U1.D13 45.08,36.07 44.58,35.56 40,35.56 37.72,33.27 30.61,33.27 v30.35,33.02 | R14.2 v12.06,33.15
  Route15 0.152: v30.35,33.02 29.72,33.66 12.57,33.66 v12.06,33.15
BT_HCI_RTS  (via drill 0.25 pad 0.51)
  Top 0.152: R13.2 10.62,33.7 10.16,34.16 v10.16,35.81 | U1.E13 45.08,37.59 44.73,37.95 40.36,37.95 37.59,35.18 v30.35,35.18
  Route15 0.152: v30.35,35.18 16.38,35.18 15.37,36.19 10.54,36.19 v10.16,35.81
BT_HCI_RX  (via drill 0.25 pad 0.51)
  Top 0.152: R16.2 14.52,33.7 14.86,34.04 v14.86,34.8 | U1.D15 42.06,36.68 40.11,36.68 37.59,34.16 v30.35,34.16
  Route15 0.152: v30.35,34.16 15.49,34.16 v14.86,34.8
BT_HCI_TX  (via drill 0.25 pad 0.51)
  Top 0.152: v15.37,35.43 15.37,33.66 14.86,33.15 13.33,33.15 13.08,33.4 R15.2 | U1.D14 43.81,36.32 43.16,36.98 39.9,36.98 37.59,34.67 v31.5,34.67
  Route15 0.152: v31.5,34.67 16.13,34.67 v15.37,35.43
CEC
  Top 0.152: J6.13 88.57,38.35 87.5,38.43 D12.1 87,38.35 86.87,38.23 86.61,38.23 86.11,38.35 85.72,38.48 83.82,38.48 83.44,38.1 83.44,37.21 82.42,36.2 R106.2 81.83,36.7 81.03,36.7 79.82,37.91 U11.17
CGND  (via drill 0.25 pad 0.51, 0.64 pad 1.27)
  Top 1.016: J3.G4 J3.G3 81.66,12.06 | 97.03,32.64 J6.PAD3 95.19,30.58 95.19,28.22 | J6.PAD2 98.97,44.62 100.34,45.98 | 85.09,86.36 MGT4.P$1 88.01,83.19 | 16.51,86.11 MGT1.P$1 13.33,83.19 | J6.PAD1 95.25,30.61 | 16.51,15.24 MGT2.P$1 13.08,19.05 | JP2.SG1 20.32,11.68 | JP2.SG2 31.75,4.95 | 85.09,15.11 MGT3.P$1 88.77,19.05
  GND2 1.016: 16.38,15.11 16.51,15.11 MGT2.P$1 16.51,19.18 12.57,19.18 | JP2.SG1 19.81,12.06 | JP2.SG2 32,4.95 | J1.P6 53.22,1.57 J1.P4 56.39,1.57 56.39,1.65 | J1.P5 48.38,1.57 J1.P3 45.59,1.57 45.59,1.52 | 85.34,15.24 85.09,15.24 MGT3.P$1 88.77,19.05 | 95.25,29.08 J6.PAD3 96.52,31.5 | 99.95,45.21 J6.PAD2 99.69,43.05 | 85.22,86.61 MGT4.P$1 88.39,83.19 | 16.51,86.61 MGT1.P$1 13.21,83.19
  Route15 1.27: 16.26,15.37 16.51,15.62 MGT2.P$1 13.08,19.05 | JP2.SG1 19.94,12.32 | JP2.SG2 32.26,4.83 | J6.PAD1 J6.PAD3 | J6.PAD3 96.39,31.37 | J6.PAD3 95.25,29.34 | J6.PAD J6.PAD2 | J6.PAD2 99.55,44.62 100.15,45.22 | J6.PAD2 99.82,43.69 | 84.96,86.61 MGT4.P$1 87.88,83.19 | 16.51,86.11 MGT1.P$1 13.59,83.19 | J1.P5 48.38,1.57 J1.P3 | J1.P6 53.22,1.57 J1.P4 | 84.84,15.11 85.09,15.37 MGT3.P$1 85.22,19.18 89.15,19.18
  Bottom 1.016: 16.51,86.36 MGT1.P$1 13.08,83.19 | 85.09,86.36 MGT4.P$1 88.01,83.19 | J6.PAD J6.PAD2 100.33,46.1 | 97.13,32.39 95.35,30.61 J6.PAD3 95.38,28.83 | 88.65,19.05 MGT3.P$1 85.09,15.11 | J1.P5 47.22,3.15 J1.P3 | J1.P6 54.38,3.15 J1.P4 | JP2.SG2 32,5.08 | JP2.SG1 20.32,11.94 | 16.38,15.24 MGT2.P$1 12.57,19.05
  other vias: 99.69,53.34 99.69,51.43 99.69,49.53 99.69,46.35 98.42,38.73 97.41,34.16 94.61,29.21 92.71,25.4 91.44,22.86 88.27,18.41 84.58,14.6 80.01,10.67 74.55,7.49 65.91,3.94 61.09,2.16 56.52,1.9 50.8,1.65 45.72,1.9 42.54,1.9 38.73,3.17 34.29,4.19 30.35,5.71 25.27,8.25 21.21,11.05 17.65,13.84 12.06,20.19 9.65,23.49 7.62,26.67 5.71,29.21 4.19,33.02 3.17,36.19 2.54,40 1.65,43.81 1.27,46.99 1.27,50.16 1.27,53.97 1.9,57.78 2.54,62.23 3.81,66.04 5.08,70.48 6.98,73.66 8.89,76.83 11.68,80.9 17.53,87.5 20.95,90.04 25.27,93.09 29.84,95.25 35.56,97.16 40.64,99.06 45.72,100.33 50.16,100.33 54.61,100.33 60.32,99.69 64.9,98.42 69.22,96.77 73.66,94.61 77.09,92.84 81.91,89.15 88.9,81.28 92.71,77.47 95.25,72.39 97.16,68.45 99.06,60.71 99.69,56.01
  pour Top (isolate 0.305, rank 6): 50.8,102.23 -0.64,102.23 -0.64,51.43 -0.64,-0.64 51.43,-0.64 102.23,-0.64 102.23,53.97 102.23,102.23
  pour Bottom (isolate 0.305, rank 6): 102.23,102.23 -0.64,102.23 -0.64,-2.54 1.9,-2.54 1.9,-0.64 102.23,-0.64
  pour Route15 (isolate 0.305, rank 6): 50.8,102.23 -0.64,102.23 -0.64,51.43 -0.64,-0.64 -0.64,-1.91 1.9,-1.91 1.9,-0.64 51.43,-0.64 102.23,-0.64 102.23,53.97 102.23,102.23
  pour GND2 (isolate 0.305, rank 6): 50.8,102.23 -0.64,102.23 -0.64,51.43 -0.64,-0.64 -0.64,-1.27 1.9,-1.27 1.9,-0.64 51.43,-0.64 102.23,-0.64 102.23,53.97 102.23,102.23
  pour Top (isolate 0.254, no thermals): 97.66,53.97 99.44,53.97 99.69,53.72 99.69,49.28 99.44,49.02 97.03,49.02 96.77,49.28 96.77,53.72 97.03,53.97
CK_N
  Top 0.114: U11.21 80.04,39.91 80.16,40.02 85.81,40.02 86.03,39.8 U14.5 U14.6 88.24,39.17 88.75,38.84 J6.12
CK_P
  Top 0.114: U11.22 80.05,40.41 80.16,40.29 86.15,40.29 86.16,40.28 U14.4 U14.7 88.39,39.75 89.15,39.75 J6.10
CLKOUT2  (via drill 0.25 pad 0.51)
  Top 0.152: R96.2 R79.2 C37.2 v57.53,22.86 | U4.36 9.2,48.08 v9.14,48.13 | v10.79,29.84 27.56,29.84 30.1,32.38 31.37,32.38 31.88,32.89 37.08,32.89 37.85,32.13 37.85,26.8 38.73,25.91 v38.73,23.24
  Route15 0.152: v57.53,22.86 45.97,22.86 45.59,23.24 v38.73,23.24
  Bottom 0.152: v9.14,48.13 9.14,46.61 7.87,45.34 7.87,42.93 8.89,41.91 8.89,31.75 v10.79,29.84
COILA+  (via drill 0.25 pad 0.51)
  other vias: 73.91,68.45 74.55,68.45 74.55,69.09 73.91,69.09
  pour Top (isolate 0.254, no thermals): 72.9,68.39 73.72,68.39 73.85,68.26 74.61,68.26 74.74,68.39 74.74,69.28 74.61,69.41 73.53,69.41 72.83,68.71 72.83,68.45
  pour Bottom (isolate 0.254, no thermals): 74.68,83.31 74.17,83.31 73.79,82.93 73.79,69.6 73.53,69.34 73.53,68.45 73.79,68.2 75.18,68.2 75.56,68.58 75.56,83.06 75.31,83.31
COILA-  (via drill 0.25 pad 0.51)
  Top 0.305: U12.24 71.11,70.24 v70.99,70.36
  other vias: 71.63,71.44 71.31,70.93 70.93,71.44
  pour Top (isolate 0.254, no thermals): 71.5,71.63 70.87,71.63 70.77,71.53 70.77,70.33 70.87,70.23 71.25,70.23 71.88,70.87 71.88,71.5 71.75,71.63
  pour Bottom (isolate 0.254, no thermals): 70.99,70.1 70.83,70.27 70.83,80.61 71.12,80.9 71.12,82.8 71.63,83.31 72.64,83.31 73.03,82.93 73.03,71.25 71.88,70.1
COILB+  (via drill 0.25 pad 0.51)
  other vias: 67.31,68.58 66.74,68.58 66.74,69.09 67.31,69.09
  pour Top (isolate 0.254, no thermals): 66.55,68.45 66.55,69.09 66.67,69.22 67.69,69.22 68.33,68.58 68.33,68.45 68.26,68.39 66.61,68.39
  pour Bottom (isolate 0.254, no thermals): 66.29,83.19 67.42,83.19 67.82,82.78 67.82,68.58 67.56,68.33 66.29,68.33 65.91,68.71 65.91,82.8
COILB-  (via drill 0.25 pad 0.51)
  Top 0.305: U12.26 70.11,70.35 v70.1,70.36
  other vias: 69.72,70.8 69.53,71.37 70.1,71.37
  pour Top (isolate 0.254, no thermals): 69.98,70.1 69.34,70.74 69.34,71.5 69.47,71.63 70.23,71.63 70.36,71.5 70.36,70.23 70.23,70.1
  pour Bottom (isolate 0.254, no thermals): 70.1,70.1 68.83,70.1 68.58,70.36 68.45,70.48 68.45,81.03 68.58,81.15 68.58,82.68 69.22,83.31 69.98,83.31 70.48,82.8 70.48,81.03 70.36,80.9 70.36,70.23 70.23,70.1
CUR_REF  (via drill 0.25 pad 0.51)
  Top 0.305: U12.17 v73.91,66.43 v73.91,66.42 | v77.98,65.66 78.03,65.61 VR1.2 78.87,63.5
  Route15 0.305: v77.98,65.66 74.68,65.66 v73.91,66.42
D0_N
  Top 0.114: U11.24 80.15,41.41 80.26,41.52 85.91,41.52 85.96,41.46 U14.2 U14.9 88.59,40.69 89.31,40.21 J6.9
D0_P
  Top 0.114: U11.25 80.15,41.91 80.26,41.79 86.03,41.79 86.1,41.71 U14.1 U14.10 88.62,41.2 89.53,41.2 J6.7
D1_N
  Top 0.114: U11.26 80.11,42.41 80.21,42.51 83.22,42.51 83.6,42.9 86.61,42.9 86.84,42.75 U13.5 U13.6 89.28,42.09 89.69,41.66 J6.6
D1_P
  Top 0.114: U11.27 80.09,42.91 80.21,42.78 83.1,42.78 83.5,43.18 86.64,43.18 86.94,43.23 U13.4 U13.7 89.33,42.62 89.92,42.65 J6.4
D2_N
  Top 0.114: U11.29 80.16,43.91 80.29,44.04 83.09,44.04 83.37,44.32 87,44.32 87.17,44.2 U13.2 U13.9 89.28,43.56 90.04,43.16 J6.3
D2_P
  Top 0.114: U11.30 80.19,44.41 80.29,44.3 82.98,44.3 83.28,44.6 87,44.6 87.3,44.68 U13.1 U13.10 89.28,44.2 90.3,44.07 J6.1
DDC_SCL  (via drill 0.25 pad 0.51)
  Top 0.152: D9.1 87.37,37.58 | 87.37,37.58 87.45,37.57 v87.5,37.56 | v87.5,37.56 88.32,37.39 J6.15 | v87.5,37.56 87.37,37.58 | R102.2 80.96,34.73 v81.03,34.67 81.08,34.72 R104.2
  Bottom 0.152: v87.5,37.56 84.61,34.67 v81.03,34.67
DDC_SDA  (via drill 0.25 pad 0.51)
  Top 0.152: D10.1 87.12,36.7 v87.5,36.7 88.21,36.88 J6.16 | R103.2 80.96,33.72 v81.03,33.78 81.1,33.71 R105.2
  Bottom 0.152: v87.5,36.7 87.12,36.7 84.77,34.35 84.71,34.29 81.53,34.29 v81.03,33.78
DIR(GPIO23)  (via drill 0.25 pad 0.51)
  Top 0.152: U1.P5 54.76,49.38 54.76,60.22 58.42,63.88 v58.42,64.13 | U12.19 74.67,67.43 v74.68,67.44 R88.1
  Route15 0.152: v58.42,64.13 71.88,64.13 72.77,65.02 72.77,66.93 73.27,67.43 74.67,67.43 v74.68,67.44
EEPROM_WP  (via drill 0.25 pad 0.51)
  Top 0.152: U1.M2 58.65,45.95 v58.47,45.95 | U1.N3 57.84,47.62 v58.44,48.23
  Bottom 0.152: v58.47,45.95 58.47,48.21 v58.44,48.23 58.44,58.39 TP10.P1
ENABLE(GPIO46)  (via drill 0.25 pad 0.51)
  Top 0.152: U1.T6 53.97,60.96 58.42,65.41 v58.42,68.58 | U12.2 67.07,67.93 66.93,68.07 65.68,68.07 R94.1 65.61,68.5 v65.41,68.71
  Route15 0.152: v65.41,68.71 58.55,68.71 v58.42,68.58
GND  (via drill 0.25 pad 0.51)
  Top 0.254: U10.1 53.61,21.48 | U10.4 51.96,22.97 51.56,23.37 v51.56,23.49 | U11.52 72.3,43.91 v73.03,43.18 | U11.50 72.19,44.91 73.15,43.94 | U11.41 74.68,43.43 v74.93,43.18 | U11.42 74.18,43.42 74.3,43.31 | U11.43 73.68,43.71 73.66,43.69 | U11.60 72.93,39.91 v73.03,40 | U11.59 73.05,40.41 73.15,40.51 | U11.61 72.93,39.41 73.15,39.62 | D10.2 v85.09,37.34 | D12.2 v85.6,39.12 | v85.85,40.89 U14.3 U14.8 | v86.61,43.81 U13.3 U13.8 | v85.34,36.7 85.34,36.32 D11.2 D13.2 | J6.17 91.19,35.56 v91.31,35.56 | J6.11 91.82,38.48 v92.07,38.48 | J6.8 v92.46,39.88 | J6.2 92.9,42.86 v93.22,42.8 | J6.5 92.58,41.4 v92.84,41.27 | C64.1 82.87,43.43 v82.88,43.42 | U12.3 69.22,67.43 69.34,67.31 v69.34,66.93 | U12.18 v71.75,66.93
  Top 0.305: R108.2 v72.64,61.02 | v40.39,55.24 41.27,55.24 41.77,55.74 U5.1 42.1,56.86 R32.1 | R70.1 v35.18,53.97 | U2.3 35.73,57.57 v35.69,57.53 | C44.1 47.15,22.7 | R80.1 50.48,18.47 v50.16,18.16 | IC1.4 51.17,10.76 C20.2 | v45.72,41.91 45.72,39.88 | U1.G12 46.35,40.77
  Top 0.406: R77.1 v24.89,63.63 | C26.1 v44.83,84.96 | U9.3 57.8,81.52 v58.04,81.28 | C53.2 76.45,65.41 v76.83,65.02 | R18.2 v18.29,67.18 | Q2.2 v6.1,55.63 | Q1.2 v6.1,49.66 | C7.1 6.48,41.91 v5.71,42.67 | C2.2 5.08,43.43 v5.21,43.31 | J1.5 52.1,5.62 v52.2,5.71 | U4.48 10.67,39.68 | 10.67,39.68 12.37,39.68 v12.57,39.88 12.66,39.96 U4.G31 U4.G32 | v10.41,36.83 10.53,36.95 U4.49 10.53,39.54 10.67,39.68 | U4.45 v11.42,41.78 v11.43,41.78 | U4.44 12.31,42.48 U4.G32 | U4.37 12.31,47.38 U4.G35 | U4.G35 12.66,47.73 | 12.66,47.73 v12.64,47.75 | 12.66,47.73 U4.G36 U4.G30 14.06,48.39 | 14.06,48.39 14.06,47.78 v14.03,47.75 | U4.G35 U4.G29 U4.G23 | 14.06,48.39 14.1,48.43 U4.G24 U4.G18 | U4.G23 15.46,47.72 v15.43,47.75 | U4.G35 U4.G34 12.7,45.63 | 12.7,45.63 U4.G28 | U4.G28 14.06,46.95 14.1,46.99 | U4.G28 U4.G22 15.46,44.67 v15.24,44.45 15.46,44.23 U4.G21 | 12.7,45.63 v12.7,44.45 12.66,44.41 U4.G33 | U4.G28 14.06,44.54 v13.97,44.45 14.06,44.36 U4.G27 | U4.G21 U4.G27 | U4.G33 U4.G27 | U4.G27 14.1,43.56 | U4.G33 U4.G32 | U4.G27 U4.G26 | 12.57,42.16 14.1,42.16 U4.G26 | U4.G20 U4.G26 | U4.G20 15.46,43.4 15.49,43.43 | 12.7,40.77 12.74,40.73 U4.G25 U4.G26 | 14.06,42 14.1,42.04 | U4.G19 15.46,40.87 | 15.46,40.87 U4.G20 | U4.G20 15.49,42.16 | 15.46,40.87 14.2,40.87 14.1,40.77 14.41,40.45 U4.54 | U4.G20 16.09,42.13 v16.51,42.54 | U4.G13 17.06,40.73 v16.51,41.27 | U4.G19 17.23,40.73 17.27,40.77 | 15.88,42.16 15.91,42.13 U4.G14 U4.G15 | U4.G15 U4.G21 | 15.49,45.59 15.53,45.63 U4.G16 17.56,44.67 v17.78,44.45 17.56,44.23 U4.G15 | U4.G23 U4.G17 17.56,48.35 17.53,48.39 | U4.G23 15.46,45.75 15.49,45.72 | U4.7 20.71,43.18 U4.G3 | U4.9 20.45,44.58 v20.32,44.45 | U4.61 19.31,40.38 18.92,40.77
  Top 0.406: U4.59 17.91,40.64 17.78,40.77 | U4.55 15.11,40.38 U4.G19 | U4.64 21.41,39.68 U4.G1 | U4.1 23.55,38.55 v23.75,38.35 | U4.15 20.71,48.78 | 20.71,48.78 20.32,48.39 | U4.17 22.48,51.17 v22.73,51.56 | U4.20 20.01,51.25 20.19,51.43 v20.07,51.56 | U4.24 17.21,51.63 v17.27,51.69 17.65,51.69 17.91,51.43 U4.23 | U4.28 14.41,51.63 v14.35,51.69 | U4.30 13.01,51.38 12.95,51.43 v12.83,51.75 | U4.33 10.53,51.17 v10.29,51.56 | U4.34 11.61,49.48 12.26,48.83 | 12.26,48.83 12.7,48.39 | U4.35 12.2,48.78 12.26,48.83 | U4.39 12.44,45.98 12.57,45.85 | U4.16 21.41,49.48 20.71,48.78 | R50.1 65.2,39.01 v65.22,38.99 | C60.2 67.12,39.5 v66.87,39.24 | C59.2 v66.87,40.51 | C63.1 v66.87,41.53 | C58.2 v66.87,42.54 | C57.2 v66.87,43.56 | C55.2 v66.87,44.58 | R43.1 v64.71,45.59 | C46.2 v66.87,45.59 | U4.31 12.31,49.92 12.32,49.91 | U4.19 20.71,49.79 20.7,49.78 | R58.1 v41.4,81.41 | R94.2 v64.13,68.13 | R119.2 v16.51,33.15
  Top 0.508: Q3.2 v6.1,52.7 | C67.2 v67.56,60.71 | C34.2 v66.8,23.49 | C32.2 v65.28,25.65 | R3.2 29.74,40.68 v29.78,40.64 | R64.1 29.74,42.82 v29.72,42.8 | C20.2 v52.58,10.79 | R46.1 v64.71,42.54 | R49.1 v64.71,40.51 | C69.1 v82.93,38.23 | R99.1 82.87,39.24 v82.88,39.23 | C65.1 82.87,40.89 v82.88,40.88 | R98.2 82.87,45.21 v82.88,45.2 | 79.63,28.07 81.53,28.07 82.42,28.96 C75.1 82.68,29.72 v82.55,29.84 | C74.1 v83.57,28.96 | R109.1 79.58,31.2 v79.63,31.24 | U16.2 77.34,28.07 v77.22,28.19 | C82.1 76.2,27.18 v76.33,27.3 | v66.93,15.62 J3.6 v65.66,17.78 | 47.15,22.7 47.02,22.7 v45.72,24
  Top 0.61: U8.2 29.21,68.58 | SW2.2 21.28,65.86 v21.21,65.79
  other vias: 50.8,46.99 53.34,46.86 55.73,46.84 45.85,36.96 48.26,36.96 53.34,36.96 55.75,36.96 55.75,39.37 55.88,41.91 55.75,44.45 50.8,36.96 67.31,52.13 68.33,52.13 68.33,49.97 67.31,49.97 69.34,52.13 70.36,52.13 71.37,52.13 72.39,52.13 73.41,52.13 74.42,52.13 76.45,52.13 69.34,49.97 70.36,49.97 71.37,49.97 72.39,49.97 73.41,49.97 74.42,49.97 75.44,49.97 76.45,49.97 77.47,49.97 78.49,49.97 74.93,41.66 41.27,28.83 28.32,64.52 28.19,62.48 29.21,68.2 29.21,70.48 29.84,70.87 29.84,72.9 54.61,81.28 53.34,81.28 53.34,78.74 52.07,78.74 50.8,78.74 49.53,78.74 47.62,77.98 47.62,79.38 43.05,75.95 41.4,77.47 40,78.87 36.07,77.72 36.07,78.74 35.05,78.74 35.05,77.72 60.32,78.1 59.05,78.1 61.59,78.1 57.78,78.1 70.61,66.93 71.75,67.94 70.61,67.94 69.34,67.94 69.34,66.04 70.61,66.04 71.75,66.04 79.38,77.47 80.64,77.47 81.91,77.47 83.19,77.47 44.45,60.96 44.45,62.23 45.72,62.23 45.72,60.96 30.86,72.9 18.29,71.75 5.97,46.86 4.7,38.86 4.7,36.83 6.98,30.35 8.25,29.21 10.16,27.94 6.35,30.35 32.38,28.07 31.88,28.7 32.89,28.7 32.89,27.43 31.88,27.43 35.56,19.68 35.56,20.32 34.92,20.32 55.24,18.16 57.53,28.83 67.69,29.21 69.34,29.84 71.5,30.35 77.34,31.24 80.01,24.13 81.28,23.49 83.82,23.49 85.09,23.49 87.76,24.38 84.45,29.84 87.12,28.7 69.22,34.92 73.41,33.15 74.93,33.15 79.25,33.02 86.11,42.42 87,45.21 85.09,45.21 83.57,49.02 19.05,44.45 16.51,44.45 16.57,47.75 18.92,47.75 20.32,47.75 73.03,41.66 76.83,41.66 76.83,43.18 74.93,40 76.83,40 10.35,52.7 10.29,53.97 9.78,54.99 8.89,55.88 8.89,57.15 8.89,58.42 12.76,52.7 12.76,53.97 13.72,54.99 14.6,55.88 14.6,57.15 14.6,58.42 20.19,52.7 20.19,53.97 19.81,54.99 19.05,55.88 18.41,57.15 18.41,58.42 22.73,52.7 22.73,53.97 23.11,54.99 24,55.88 24.76,57.15 24.76,58.42 79.38,28.83 34.92,19.68 93.98,49.53 92.71,49.53 93.98,51.43 92.71,51.43 92.71,53.34 95.25,51.43 6.98,58.42 4.45,58.42 4.45,57.15 6.98,57.15 6.98,60.32 4.45,60.32 8.89,60.32 8.89,62.86 6.98,62.86 5.08,62.86 12.06,62.86 14.6,62.86 12.06,60.32 14.6,60.32 13.97,52.7 16.51,52.7 18.41,52.7 17.78,54.99 16.51,54.99 16.51,57.15 16.51,58.42 16.51,60.32 18.41,60.32 18.41,62.86 16.51,62.86 21.46,60.32 21.46,62.86 24.76,62.86 24.76,60.32 24.13,53.97 24.13,52.07 23.11,64.77 19.94,64.77 17.65,64.77 13.46,64.77 10.54,64.77 6.98,64.77 10.16,73.66 14.6,76.83 22.22,81.91 24.76,76.83 19.68,76.83 24.76,74.3 24.76,81.91 32.38,81.91 32.38,79.38 34.92,87 37.46,92.07 42.54,94.61 50.16,97.16 55.24,97.16 60.32,94.61 65.41,92.07 62.86,87 62.86,81.91 50.16,64.13 50.8,66.04 50.8,68.58 38.1,63.5 35.56,63.5 38.1,64.96 35.56,62.42 63.5,78.74 78.74,78.74 78.74,83.82 73.66,86.36 68.58,86.36 83.82,78.74 88.9,76.2 91.82,73.28 81.28,63.5 86.36,58.42 91.44,53.34 91.44,48.26 55.88,78.74 55.88,81.28 33.02,57.91 33.02,55.88 30.48,50.29 30.48,47.75 25.4,40.64 25.4,38.1 25.4,36.58 25.4,33.02 25.4,30.48 25.4,27.94 20.32,27.94 15.24,27.94 25.4,22.86 20.32,22.86 35.56,15.24 40.64,10.16 45.72,7.62 55.88,7.62 55.88,12.7 60.96,12.7 60.96,7.62 60.96,17.78 58.42,25.4 50.8,25.4 48.26,25.4 58.42,22.86 63.5,27.94 63.5,30.48 68.58,27.94 71.12,27.94 71.12,22.86 76.2,22.86 78.74,20.32 83.82,30.48 81.28,30.48 65.02,35.56 66.42,48.26 66.42,46.74 60.96,53.34 60.96,55.88 63.5,55.88 78.74,55.88 78.74,50.8 83.82,50.8 86.36,48.26 81.28,55.88 60.32,66.67 60.32,65.41 28.19,58.42 28.19,61.85 28.19,60.32 79.38,27.69 75.56,28.19 43.94,22.61 44.07,21.84 44.83,22.61 44.96,21.84 38.73,22.22 62.86,35.56 62.86,38.1
  pour Top (rank 4): 45.72,36.83 49.53,36.83 49.53,36.19 52.07,36.19 52.07,36.83 55.88,36.83 55.88,40.64 56.52,40.64 56.52,43.18 55.88,43.18 55.88,46.99 52.07,46.99 52.07,47.62 49.53,47.62 49.53,46.99 45.72,46.99 45.72,43.18 45.08,43.18 45.08,40.64 46.35,40.64 46.35,46.35 55.24,46.35 55.24,37.46 46.35,37.46 46.35,40 45.72,40
  pour Top (isolate 0.254, no thermals): 53.97,82.68 48.77,82.68 48.39,82.3 48.39,80.64 47.88,80.14 46.48,80.14 46.23,79.88 46.23,76.83 45.97,76.58 42.67,76.58 41.02,78.23 39.5,79.76 35.31,79.76 34.92,79.38 34.92,77.72 35.31,77.34 40.77,77.34 42.67,75.44 42.67,74.8 42.93,74.55 43.56,74.55 43.69,74.68 43.69,75.56 43.94,75.82 44.2,76.07 46.61,76.07 47.12,76.58 54.61,76.58 55.24,77.22 55.24,82.3 54.86,82.68
  pour Top (isolate 0.254, no thermals): 59.05,72.52 57.53,72.52 57.15,72.9 57.15,78.23 57.4,78.49 61.59,78.49 61.85,78.23 61.85,75.18 60.83,74.17 60.83,72.9 60.45,72.52 59.18,72.52
  pour Top (isolate 0.254, no thermals): 81.91,72.14 80.52,72.14 80.14,72.52 80.14,75.31 78.99,76.45 78.99,77.72 79.25,77.98 83.44,77.98 83.82,77.6 83.82,72.64 83.31,72.14
  pour Top (isolate 0.254, no thermals): 44.32,56.64 44.07,56.64 43.94,56.77 43.94,62.36 44.2,62.61 45.85,62.61 46.1,62.36 46.1,59.69 45.72,59.31 45.72,56.9 45.47,56.64
  pour Top (isolate 0.254, no thermals): 31.11,71.88 31.11,73.79 30.48,74.42 29.72,74.42 29.59,74.3 29.59,71.25 28.96,70.61 28.96,67.31 27.56,65.91 27.56,62.41 27.74,62.23 28.65,62.23 28.83,62.41 28.83,66.29 29.59,67.06 29.59,70.36
  pour Top (isolate 0.254, no thermals): 69.6,74.55 72.52,74.55 72.77,74.8 72.77,77.09 72.39,77.47 68.33,77.47 67.82,76.96 67.82,75.06 68.33,74.55
  pour Top (isolate 0.254, no thermals): 5.08,44.07 4.95,44.07 4.83,43.94 4.83,42.93 5.59,42.16 5.59,41.15 4.45,40 4.45,36.32 4.83,35.94 5.59,35.94 5.97,36.32 5.97,39.5 6.6,40.13 6.6,40.89 6.98,41.27 7.75,41.27 8,41.53 8,42.29 7.75,42.54 7.11,42.54 5.59,44.07
  pour Top (isolate 0.254, no thermals): 6.48,32 5.97,32 5.59,31.62 5.59,31.24 5.71,30.61 10.03,27.3 10.67,27.3 10.92,27.3 11.05,27.43 11.05,28.96 10.54,29.46 10.03,29.46 7.49,32
  pour Top (isolate 0.254, no thermals): 33.02,21.21 33.66,21.21 34.54,20.32 36.7,20.32 36.96,20.57 36.96,21.84 36.83,21.97 35.05,21.97 34.29,22.73 33.78,23.24 33.02,23.24 32.77,22.99 32.77,22.1 32.89,21.97 32.89,21.34
  pour Top (isolate 0.254, no thermals): 93.73,53.97 95.25,53.97 95.5,53.72 95.5,49.28 95.25,49.02 92.84,49.02 92.71,49.15 92.71,53.72 92.96,53.97
  pour Top (isolate 0.254, rank 5): 50.8,99.06 arc-90 99.06,50.8 arc-90 50.8,2.54 arc-90 2.54,50.8 arc-90
  pour Bottom (isolate 0.254, rank 5): 50.8,99.06 arc-90 99.06,50.8 arc-90 50.8,2.54 arc-90 2.54,50.8 arc-90
  pour GND2 (isolate 0.254, rank 5): 50.8,99.06 arc-90 99.06,50.8 arc-90 50.8,2.54 arc-90 2.54,50.8 arc-90
  pour Route15 (isolate 0.152, rank 5): 50.8,99.06 arc-90 99.06,50.8 arc-90 50.8,2.54 arc-90 2.54,50.8 arc-90
HDMI_1V2  (via drill 0.25 pad 0.51)
  Top 0.254: U11.35 77.68,47.16 77.47,47.37 | U11.56 69.47,41.91 69.34,41.78 | U11.28 80.36,43.41 80.39,43.43 | U11.23 80.38,40.91 80.39,40.89 | U11.8 74.68,35.94 73.85,35.12 v73.66,35.12 | U11.18 80.21,38.41 v81.03,37.59
  Top 0.508: 77.47,47.37 v77.47,48.01 C62.2 | 69.34,41.78 69.09,41.53 v68.83,41.53 C63.2 | 80.39,43.43 v80.9,43.43 C64.2 | 80.39,40.89 v80.9,40.89 C65.2 | C61.2 v73.66,35.12 | C66.2 81.41,37.21 v81.03,37.59 | R113.2 73.7,30.65 v73.66,30.61 73.79,30.48 C83.2 C82.2 L10.2